# Altium project UCLA-DRS4-2.1.PrjPCB (part 6 of 7)

## Sheet Sensors.SchDoc: Sensors
size OrCAD B; SheetNumber: 24; SheetTotal: 32
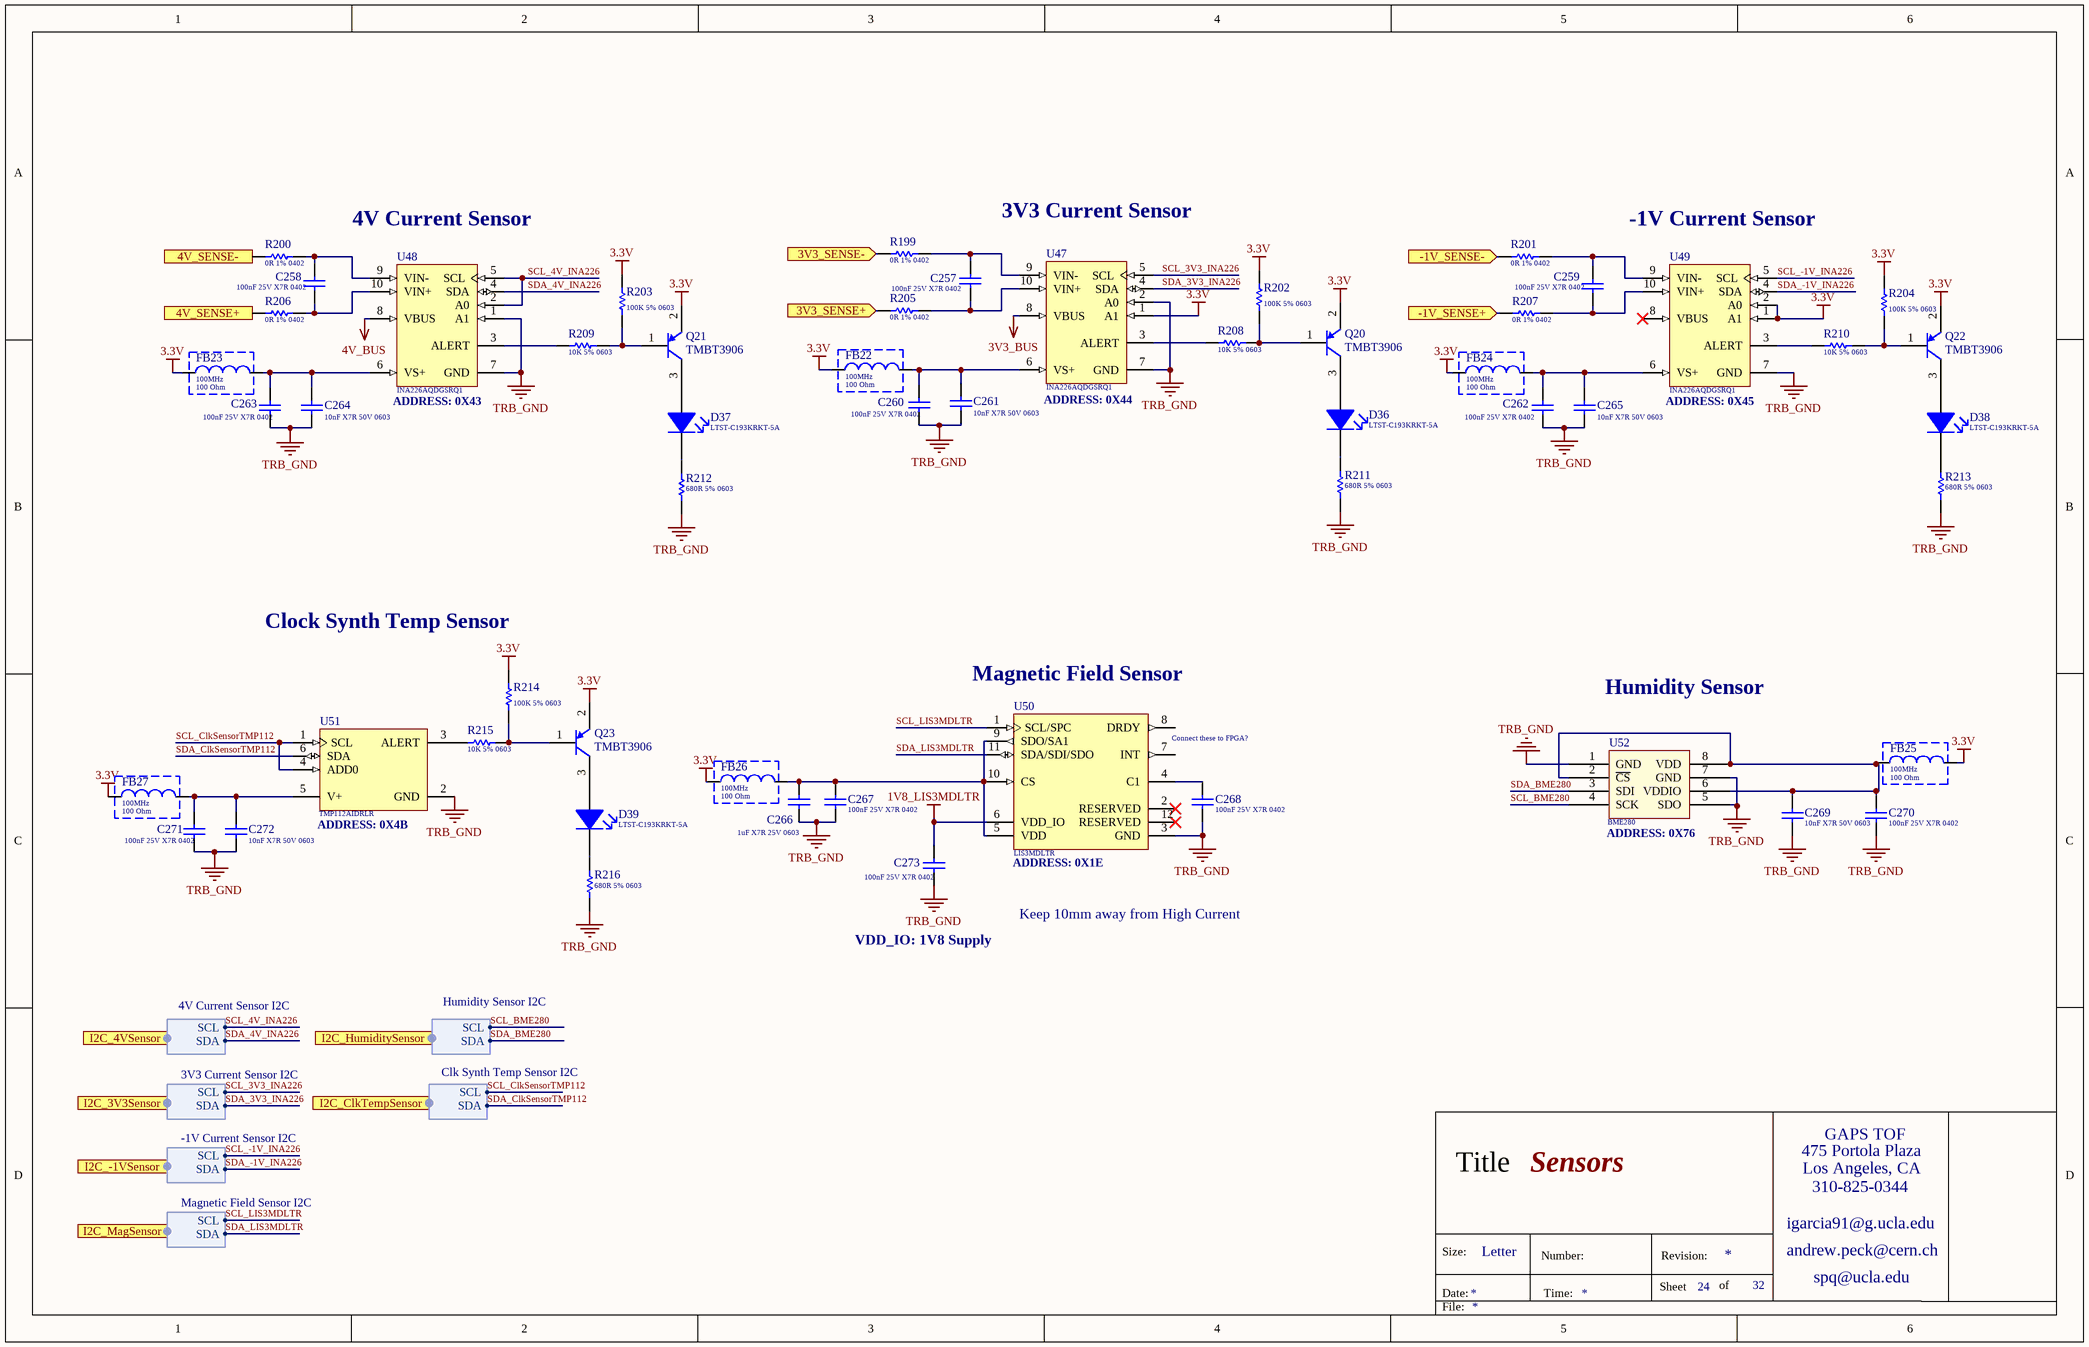
[diagram p23: Sensors.SchDoc]

### Parts
C257  Capacitance: 100nF 25V X7R 0402  [Cap_Taiyo_Yuden_TMK105B7104KV-FR_100nF]  (hidden comment: Cap_Taiyo_Yuden_TMK105B7104KV-FR_100nF)
C258  Capacitance: 100nF 25V X7R 0402  [Cap_Taiyo_Yuden_TMK105B7104KV-FR_100nF]  (hidden comment: Cap_Taiyo_Yuden_TMK105B7104KV-FR_100nF)
C259  Capacitance: 100nF 25V X7R 0402  [Cap_Taiyo_Yuden_TMK105B7104KV-FR_100nF]  (hidden comment: Cap_Taiyo_Yuden_TMK105B7104KV-FR_100nF)
C260  Capacitance: 100nF 25V X7R 0402  [Cap_Taiyo_Yuden_TMK105B7104KV-FR_100nF]  (hidden comment: Cap_Taiyo_Yuden_TMK105B7104KV-FR_100nF)
C261  Capacitance: 10nF X7R 50V 0603  [Kemet_C0603_0]  (hidden comment: Cap_Kemet_C0603C103J5RACTU_eec)
C262  Capacitance: 100nF 25V X7R 0402  [Cap_Taiyo_Yuden_TMK105B7104KV-FR_100nF]  (hidden comment: Cap_Taiyo_Yuden_TMK105B7104KV-FR_100nF)
C263  Capacitance: 100nF 25V X7R 0402  [Cap_Taiyo_Yuden_TMK105B7104KV-FR_100nF]  (hidden comment: Cap_Taiyo_Yuden_TMK105B7104KV-FR_100nF)
C264  Capacitance: 10nF X7R 50V 0603  [Kemet_C0603_0]  (hidden comment: Cap_Kemet_C0603C103J5RACTU_eec)
C265  Capacitance: 10nF X7R 50V 0603  [Kemet_C0603_0]  (hidden comment: Cap_Kemet_C0603C103J5RACTU_eec)
C266  Capacitance: 1uF X7R 25V 0603  [Cap_Murata_GCJ188R71E105KA01J_1uF]  (hidden comment: Cap_Murata_GCJ188R71E105KA01J_1uF)
C267  Capacitance: 100nF 25V X7R 0402  [Cap_Taiyo_Yuden_TMK105B7104KV-FR_100nF]  (hidden comment: Cap_Taiyo_Yuden_TMK105B7104KV-FR_100nF)
C268  Capacitance: 100nF 25V X7R 0402  [Cap_Taiyo_Yuden_TMK105B7104KV-FR_100nF]  (hidden comment: Cap_Taiyo_Yuden_TMK105B7104KV-FR_100nF)
C269  Capacitance: 10nF X7R 50V 0603  [Kemet_C0603_0]  (hidden comment: Cap_Kemet_C0603C103J5RACTU_eec)
C270  Capacitance: 100nF 25V X7R 0402  [Cap_Taiyo_Yuden_TMK105B7104KV-FR_100nF]  (hidden comment: Cap_Taiyo_Yuden_TMK105B7104KV-FR_100nF)
C271  Capacitance: 100nF 25V X7R 0402  [Cap_Taiyo_Yuden_TMK105B7104KV-FR_100nF]  (hidden comment: Cap_Taiyo_Yuden_TMK105B7104KV-FR_100nF)
C272  Capacitance: 10nF X7R 50V 0603  [Kemet_C0603_0]  (hidden comment: Cap_Kemet_C0603C103J5RACTU_eec)
C273  Capacitance: 100nF 25V X7R 0402  [Cap_Taiyo_Yuden_TMK105B7104KV-FR_100nF]  (hidden comment: Cap_Taiyo_Yuden_TMK105B7104KV-FR_100nF)
D36  LTST-C193KRKT-5A  [Led_Lite-On_LTST-C193KGKT-5A_Red]
D37  LTST-C193KRKT-5A  [Led_Lite-On_LTST-C193KGKT-5A_Red]
D38  LTST-C193KRKT-5A  [Led_Lite-On_LTST-C193KGKT-5A_Red]
D39  LTST-C193KRKT-5A  [Led_Lite-On_LTST-C193KGKT-5A_Red]
FB22  Measuring Frequency: 100MHz  Impedance: 100 Ohm  [FB_Wurth_Electronics_742792731_100Ohms]  (hidden comment: 742792731)
FB23  Measuring Frequency: 100MHz  Impedance: 100 Ohm  [FB_Wurth_Electronics_742792731_100Ohms]  (hidden comment: 742792731)
FB24  Measuring Frequency: 100MHz  Impedance: 100 Ohm  [FB_Wurth_Electronics_742792731_100Ohms]  (hidden comment: 742792731)
FB25  Measuring Frequency: 100MHz  Impedance: 100 Ohm  [FB_Wurth_Electronics_742792731_100Ohms]  (hidden comment: 742792731)
FB26  Measuring Frequency: 100MHz  Impedance: 100 Ohm  [FB_Wurth_Electronics_742792731_100Ohms]  (hidden comment: 742792731)
FB27  Measuring Frequency: 100MHz  Impedance: 100 Ohm  [FB_Wurth_Electronics_742792731_100Ohms]  (hidden comment: 742792731)
Q20  Series: TMBT3906  [BJT_PNP_Toshiba_TMBT3906]  (hidden comment: BJT_PNP_Toshiba_TMBT3906)
Q21  Series: TMBT3906  [BJT_PNP_Toshiba_TMBT3906]  (hidden comment: BJT_PNP_Toshiba_TMBT3906)
Q22  Series: TMBT3906  [BJT_PNP_Toshiba_TMBT3906]  (hidden comment: BJT_PNP_Toshiba_TMBT3906)
Q23  Series: TMBT3906  [BJT_PNP_Toshiba_TMBT3906]  (hidden comment: BJT_PNP_Toshiba_TMBT3906)
R199  Resistance: 0R 1% 0402  [Res_Vishay_CRCW04020000Z0EDC_0_Ohm]  (hidden comment: Res_Vishay_CRCW04020000Z0EDC_0_Ohm)
R200  Resistance: 0R 1% 0402  [Res_Vishay_CRCW04020000Z0EDC_0_Ohm]  (hidden comment: Res_Vishay_CRCW04020000Z0EDC_0_Ohm)
R201  Resistance: 0R 1% 0402  [Res_Vishay_CRCW04020000Z0EDC_0_Ohm]  (hidden comment: Res_Vishay_CRCW04020000Z0EDC_0_Ohm)
R202  100K 5% 0603  [RESC0603(1608)_N]
R203  100K 5% 0603  [RESC0603(1608)_N]
R204  100K 5% 0603  [RESC0603(1608)_N]
R205  Resistance: 0R 1% 0402  [Res_Vishay_CRCW04020000Z0EDC_0_Ohm]  (hidden comment: Res_Vishay_CRCW04020000Z0EDC_0_Ohm)
R206  Resistance: 0R 1% 0402  [Res_Vishay_CRCW04020000Z0EDC_0_Ohm]  (hidden comment: Res_Vishay_CRCW04020000Z0EDC_0_Ohm)
R207  Resistance: 0R 1% 0402  [Res_Vishay_CRCW04020000Z0EDC_0_Ohm]  (hidden comment: Res_Vishay_CRCW04020000Z0EDC_0_Ohm)
R208  10K 5% 0603  [RESC0603(1608)_L]
R209  10K 5% 0603  [RESC0603(1608)_L]
R210  10K 5% 0603  [RESC0603(1608)_L]
R211  680R 5% 0603  [RESC0603(1608)_L]
R212  680R 5% 0603  [RESC0603(1608)_L]
R213  680R 5% 0603  [RESC0603(1608)_L]
R214  100K 5% 0603  [RESC0603(1608)_N]
R215  10K 5% 0603  [RESC0603(1608)_L]
R216  680R 5% 0603  [RESC0603(1608)_L]
U47  INA226AQDGSRQ1  [INA226AQDGSRQ1]
U48  INA226AQDGSRQ1  [INA226AQDGSRQ1]
U49  INA226AQDGSRQ1  [INA226AQDGSRQ1]
U50  LIS3MDLTR  [LIS3MDLTR]
U51  TMP112AIDRLR  [TMP112AIDRLR]
U52  BME280  [BME280]

### Ports
3V3_SENSE+ (in), 3V3_SENSE- (in), 4V_SENSE+ (in), 4V_SENSE- (in), -1V_SENSE+ (in), -1V_SENSE- (in), I2C_3V3Sensor (harness 3V3 Current Sensor I2C), I2C_4VSensor (harness 4V Current Sensor I2C), I2C_-1VSensor (harness -1V Current Sensor I2C), I2C_ClkTempSensor (harness Clk Synth Temp Sensor I2C), I2C_HumiditySensor (harness Humidity Sensor I2C), I2C_MagSensor (harness Magnetic Field Sensor I2C)

### Harnesses
4V Current Sensor I2C: SCL, SDA
3V3 Current Sensor I2C: SCL, SDA
-1V Current Sensor I2C: SCL, SDA
Magnetic Field Sensor I2C: SCL, SDA
Humidity Sensor I2C: SCL, SDA
Clk Synth Temp Sensor I2C: SCL, SDA

### Nets
1V8_LIS3MDLTR: C273.2 U50.6(VDD_IO)
3.3V: FB22.1 FB23.1 FB24.1 FB25.2 FB26.1 FB27.1 Q20.2(E) Q21.2(E) Q22.2(E) Q23.2(E) R202.2 R203.2 R204.2 R214.2 U47.1(A1) U47.8(VBUS) U49.1(A1) U49.2(A0)  [also labelled 3V3_BUS]
4V_BUS: U48.8(VBUS)  [project net 4V]
TRB_GND: C260.1 C261.2 C262.1 C263.1 C264.2 C265.2 C266.1 C267.2 C268.2 C269.2 C270.2 C271.1 C272.2 C273.1 R211.1 R212.1 R213.1 R216.1 U47.2(A0) U47.7(GND) U48.1(A1) U48.7(GND) U49.7(GND) U50.3(GND) U51.2(GND) U52.1(GND) U52.5(SDO) U52.7(GND)
3V3_SENSE_N: R199.2 ; port 3V3_SENSE-
3V3_SENSE_P: R205.2 ; port 3V3_SENSE+
4V_SENSE_N: R200.2 ; port 4V_SENSE-
4V_SENSE_P: R206.2 ; port 4V_SENSE+
-1V_SENSE_N: R201.2 ; port -1V_SENSE-
-1V_SENSE_P: R207.2 ; port -1V_SENSE+
SCL_3V3_INA226: U47.5(SCL) ; port I2C_3V3Sensor.SCL
SCL_4V_INA226: U48.2(A0) U48.5(SCL) ; port I2C_4VSensor.SCL
SCL_-1V_INA226: U49.5(SCL) ; port I2C_-1VSensor.SCL
SCL_BME280: U52.4(SCK) ; port I2C_HumiditySensor.SCL
SCL_ClkSensorTMP112: U51.1(SCL) U51.4(ADD0) ; port I2C_ClkTempSensor.SCL
SCL_LIS3MDLTR: U50.1(SCL/SPC) ; port I2C_MagSensor.SCL
SDA_3V3_INA226: U47.4(SDA) ; port I2C_3V3Sensor.SDA
SDA_4V_INA226: U48.4(SDA) ; port I2C_4VSensor.SDA
SDA_-1V_INA226: U49.4(SDA) ; port I2C_-1VSensor.SDA
SDA_BME280: U52.3(SDI) ; port I2C_HumiditySensor.SDA
SDA_ClkSensorTMP112: U51.6(SDA) ; port I2C_ClkTempSensor.SDA
SDA_LIS3MDLTR: U50.11(SDA/SDI/SDO) ; port I2C_MagSensor.SDA
NetC257_1: C257.1 R205.1 U47.10(VIN+)
NetC257_2: C257.2 R199.1 U47.9(VIN-)
NetC258_1: C258.1 R206.1 U48.10(VIN+)
NetC258_2: C258.2 R200.1 U48.9(VIN-)
NetC259_1: C259.1 R207.1 U49.10(VIN+)
NetC259_2: C259.2 R201.1 U49.9(VIN-)
NetC260_2: C260.2 C261.1 FB22.2 U47.6(VS+)
NetC262_2: C262.2 C265.1 FB24.2 U49.6(VS+)
NetC263_2: C263.2 C264.1 FB23.2 U48.6(VS+)
NetC266_2: C266.2 C267.1 FB26.2 U50.5(VDD) U50.9(SDO/SA1) U50.10(CS)
NetC268_1: C268.1 U50.4(C1)
NetC269_1: C269.1 C270.1 FB25.1 U52.2(~{CS}) U52.6(VDDIO) U52.8(VDD)
NetC271_2: C271.2 C272.1 FB27.2 U51.5(V+)
NetD36_1: D36.1(K) R211.2
NetD36_2: D36.2(A) Q20.3(C)
NetD37_1: D37.1(K) R212.2
NetD37_2: D37.2(A) Q21.3(C)
NetD38_1: D38.1(K) R213.2
NetD38_2: D38.2(A) Q22.3(C)
NetD39_1: D39.1(K) R216.2
NetD39_2: D39.2(A) Q23.3(C)
NetQ20_1: Q20.1(B) R202.1 R208.1
NetQ21_1: Q21.1(B) R203.1 R209.1
NetQ22_1: Q22.1(B) R204.1 R210.1
NetQ23_1: Q23.1(B) R214.1 R215.1
NetR208_2: R208.2 U47.3(ALERT)
NetR209_2: R209.2 U48.3(ALERT)
NetR210_2: R210.2 U49.3(ALERT)
NetR215_2: R215.2 U51.3(ALERT)

Not connected (* = marked no-connect by the designer): U49 8(VBUS)*; U50 2(RESERVED)* 7(INT) 8(DRDY) 12(RESERVED)*

### Notes on the sheet
- 3V3 Current Sensor
- 4V Current Sensor
- -1V Current Sensor
- (near U48) ADDRESS: 0X43
- (near U47) ADDRESS: 0X44
- (near U49) ADDRESS: 0X45
- (near R214) Clock Synth Temp Sensor
- (near U50) Magnetic Field Sensor
- Humidity Sensor
- (near U50) Connect these to FPGA?
- (near U51) ADDRESS: 0X4B
- (near U50) ADDRESS: 0X1E
- (near U52) ADDRESS: 0X76
- VDD_IO: 1V8 Supply
- Keep 10mm away from High Current
- 475 Portola Plaza
- GAPS TOF
- Title
- igarcia91@g.ucla.edu
- Los Angeles, CA
- 310-825-0344
- Size:
- Date:
- Letter
- Number:
- Time:
- Sheet
- Revision:
- of
- andrew.peck@cern.ch
- spq@ucla.edu
- File:

### Library data of the parts
C257-C260 C262 C263 C267 C268 C270 C271 C273 = Cap_Taiyo_Yuden_TMK105B7104KV-FR_100nF: CAP CER 100nF 25V X7R 0402; Supplier 1: Mouser; Supplier Part Number 1: 963-TMK105B7104KV-FR
C261 C264 C265 C269 C272 = Cap_Kemet_C0603C103J5RACTU_eec: CAP CER 10nF 50V X7R 0603; Manufacturer: Kemet; Mfg Package Ident: C0603; Part Number: C0603C103J5RACTU; helpURL: https://upverter.com/upn/revision/8a8d0c297e33ac74/; ComponentLink2Description: Datasheet; Temperature: -55°C to +125°C; Package: C0603; Supplier 2: Mouser; Price: 0.0184203126773; Supplier 1: Digi-Key; ComponentLink1URL: https://upverter.com/upn/revision/8a8d0c297e33ac74/; Supplier Part Number 2: 80-C0603C103J5R; Supplier Part Number 1: 399-1092-1-ND; Value: 10nF; ComponentLink1Description: Upverter; ComponentLink2URL: https://content.kemet.com/datasheets/KEM_C1002_X7R_SMD.pdf; RoHS: TRUE; Mouser Part Number: 80-C0603C103J5R; Temperature Range High: +125°C; Digikey Description: CAP CER 10000PF 50V X7R 0603; Digikey Part Number: 399-1092-1-ND; Lead Free: yes; Temperature Range Low: -55°C; Voltage: 50V
C266 = Cap_Murata_GCJ188R71E105KA01J_1uF: CAP CER 1uF 25V X7R 0603; Supplier 1: Mouser; Supplier Part Number 1: 81-GCJ188R71E105KA1J
D36-D39 = Led_Lite-On_LTST-C193KGKT-5A_Red: Standard LEDs - SMD Red 470nm 28mcd 20mA; Supplier 1: Mouser; Supplier Part Number 1: 859-LTSTC193KRKT5A; Series: LTST-C193KRKT-5A
FB22-FB27 = FB_Wurth_Electronics_742792731_100Ohms: FB SMD 100 OHM 25% 1.2A 0402; DC Resistance: 90mOhm; Supplier 1: Mouser; Supplier Part Number 1: 710-742792731
Q20-Q23 = BJT_PNP_Toshiba_TMBT3906: Bipolar Transistors - BJT Transistor for Low Freq. Amplification; Supplier 1: Mouser; Supplier Part Number 1: TMBT3906,LM
R199-R201 R205-R207 = Res_Vishay_CRCW04020000Z0EDC_0_Ohm: 0R 0.062W 1% 0402 (1005 Metric)  SMD; Supplier 1: Mouser; Supplier Part Number 1: 71-CRCW04020000Z0EDC
R202-R204 R214 = CMP-1012-00122-1: 100K 0.1W 5% 0603 (1608 Metric)  SMD; Case-EIA: 0603; Value: 100000.00 Ohm; Case-Metric: 1608; Tolerance: 5 %; Power: 0.1 W; Technology: SMT
R208-R210 R215 = CMP-1012-00098-1: 10K 0.1W 5% 0603 (1608 Metric)  SMD; Case-EIA: 0603; Value: 10000.00 Ohm; Case-Metric: 1608; Technology: SMT; Tolerance: 5 %; Power: 0.1 W
R211-R213 R216 = CMP-1012-00070-1: 680R 0.1W 5% 0603 (1608 Metric)  SMD; Case-EIA: 0603; Value: 680.00 Ohm; Case-Metric: 1608; Tolerance: 5 %; Technology: SMT; Power: 0.1 W
U47-U49 = INA226AQDGSRQ1: Current & Power Monitors & Regulators Automotive, 36-V, Ultra-High Accuracy, Low-/High-Side, I2C Out Current/Power Monitor w/ Alert 10-VSSOP -40 to 125; Supplier 1: Mouser; Supplier Part Number 1: 595-INA226AQDGSRQ1
U50 = LIS3MDLTR: Board Mount Hall Effect / Magnetic Sensors Ultra Lo-Pwr Hi Perf 3-Axis 1.9-3.6V; Supplier 1: Mouser; Supplier Part Number 1: 511-LIS3MDLTR
U51 = TMP112AIDRLR: Board Mount Temperature Sensors Hi-Prec Lo-Pwr Dig Temp Sensor; Supplier 1: Mouser; Supplier Part Number 1: 595-TMP112AIDRLR
U52 = BME280: Board Mount Humidity Sensors; Supplier 1: Mouser; Supplier Part Number 1: 262-BME280

## Sheet MARS_GPIO_MISC.SchDoc: My title
size A3; Organization: University of California; Address1: 475 Portola Plaza; Address2: Los Angeles, CA 90095; Revision: R01; SheetNumber: 1; SheetTotal: 1
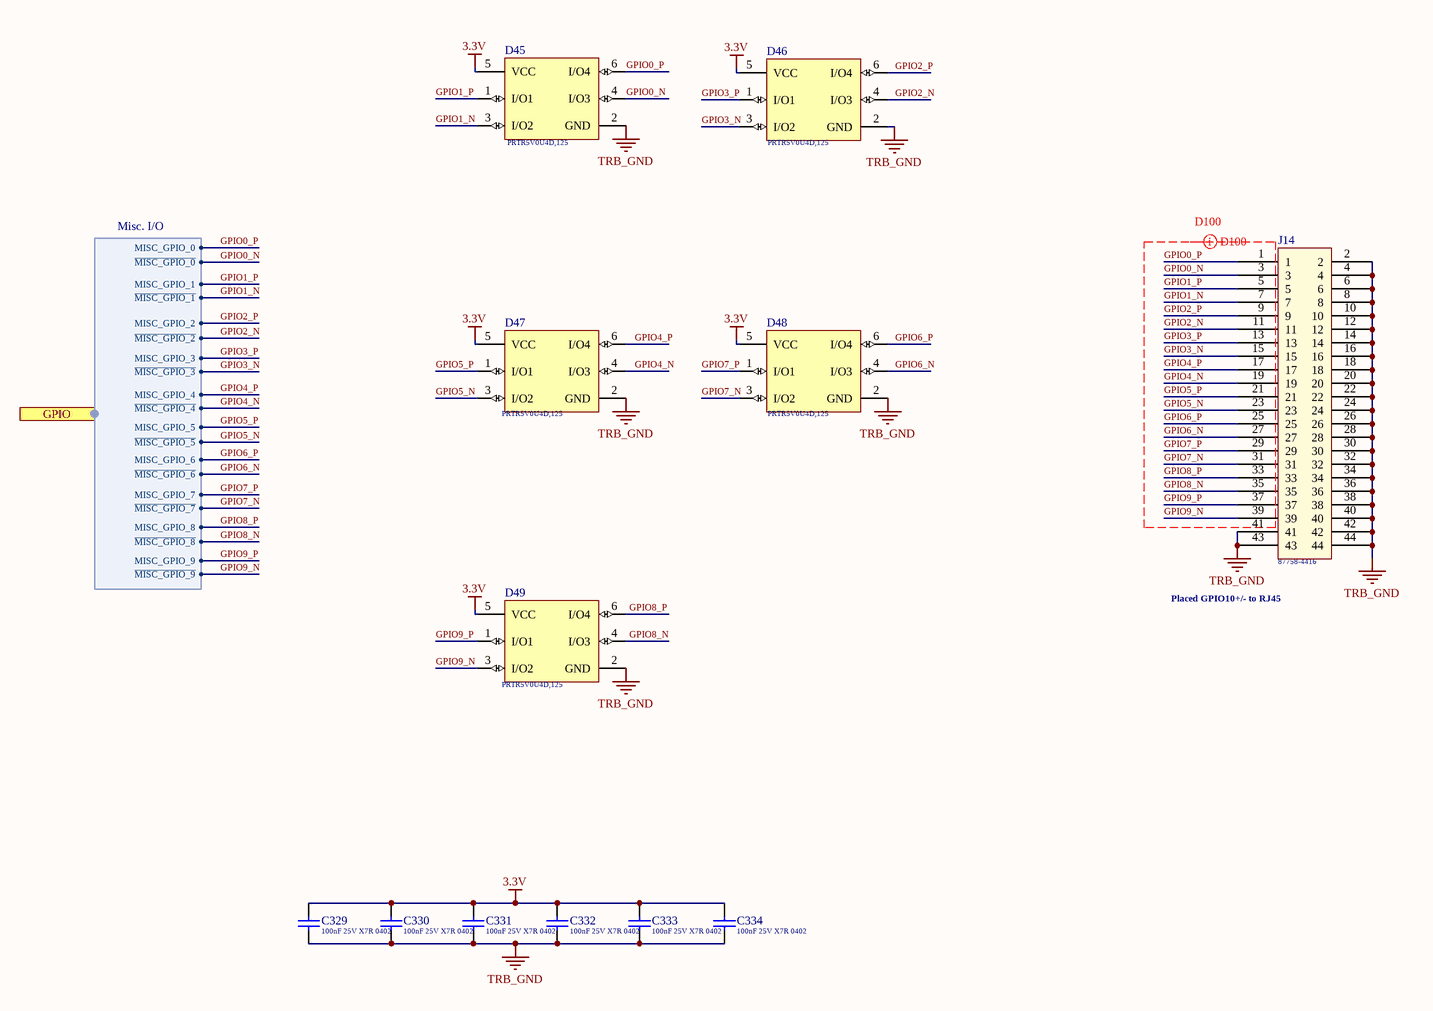
[diagram p24: MARS_GPIO_MISC.SchDoc]

### Parts
C329  Capacitance: 100nF 25V X7R 0402  [Cap_Taiyo_Yuden_TMK105B7104KV-FR_100nF]  (hidden comment: Cap_Taiyo_Yuden_TMK105B7104KV-FR_100nF)
C330  Capacitance: 100nF 25V X7R 0402  [Cap_Taiyo_Yuden_TMK105B7104KV-FR_100nF]  (hidden comment: Cap_Taiyo_Yuden_TMK105B7104KV-FR_100nF)
C331  Capacitance: 100nF 25V X7R 0402  [Cap_Taiyo_Yuden_TMK105B7104KV-FR_100nF]  (hidden comment: Cap_Taiyo_Yuden_TMK105B7104KV-FR_100nF)
C332  Capacitance: 100nF 25V X7R 0402  [Cap_Taiyo_Yuden_TMK105B7104KV-FR_100nF]  (hidden comment: Cap_Taiyo_Yuden_TMK105B7104KV-FR_100nF)
C333  Capacitance: 100nF 25V X7R 0402  [Cap_Taiyo_Yuden_TMK105B7104KV-FR_100nF]  (hidden comment: Cap_Taiyo_Yuden_TMK105B7104KV-FR_100nF)
C334  Capacitance: 100nF 25V X7R 0402  [Cap_Taiyo_Yuden_TMK105B7104KV-FR_100nF]  (hidden comment: Cap_Taiyo_Yuden_TMK105B7104KV-FR_100nF)
D45  PRTR5V0U4D,125  [PRTR5V0U4D,125]
D46  PRTR5V0U4D,125  [PRTR5V0U4D,125]
D47  PRTR5V0U4D,125  [PRTR5V0U4D,125]
D48  PRTR5V0U4D,125  [PRTR5V0U4D,125]
D49  PRTR5V0U4D,125  [PRTR5V0U4D,125]
J14  Series: 87758-4416  [Header_Molex_87758-4416_44POS]  (hidden comment: Header_Molex_87758-4416_44POS)

### Ports
GPIO (harness Misc. I/O)

### Harnesses
Misc. I/O: MISC_GPIO_0, ~{MISC_GPIO_0}, MISC_GPIO_1, ~{MISC_GPIO_1}, MISC_GPIO_2, ~{MISC_GPIO_2}, MISC_GPIO_3, ~{MISC_GPIO_3}, MISC_GPIO_4, ~{MISC_GPIO_4}, MISC_GPIO_5, ~{MISC_GPIO_5}, MISC_GPIO_6, ~{MISC_GPIO_6}, MISC_GPIO_7, ~{MISC_GPIO_7}, MISC_GPIO_8, ~{MISC_GPIO_8}, MISC_GPIO_9, ~{MISC_GPIO_9}

### Nets
3.3V: C329.2 C330.2 C331.2 C332.2 C333.2 C334.2 D45.5(VCC) D46.5(VCC) D47.5(VCC) D48.5(VCC) D49.5(VCC)
TRB_GND: C329.1 C330.1 C331.1 C332.1 C333.1 C334.1 D45.2(GND) D46.2(GND) D47.2(GND) D48.2(GND) D49.2(GND) J14.2 J14.4 J14.6 J14.8 J14.10 J14.12 J14.14 J14.16 J14.18 J14.20 J14.22 J14.24 J14.26 J14.28 J14.30 J14.32 J14.34 J14.36 J14.38 J14.40 J14.41 J14.42 J14.43 J14.44
GPIO0_N: D45.4(I/O3) J14.3 ; port GPIO.~{MISC_GPIO_0}
GPIO0_P: D45.6(I/O4) J14.1 ; port GPIO.MISC_GPIO_0
GPIO1_N: D45.3(I/O2) J14.7 ; port GPIO.~{MISC_GPIO_1}
GPIO1_P: D45.1(I/O1) J14.5 ; port GPIO.MISC_GPIO_1
GPIO2_N: D46.4(I/O3) J14.11 ; port GPIO.~{MISC_GPIO_2}
GPIO2_P: D46.6(I/O4) J14.9 ; port GPIO.MISC_GPIO_2
GPIO3_N: D46.3(I/O2) J14.15 ; port GPIO.~{MISC_GPIO_3}
GPIO3_P: D46.1(I/O1) J14.13 ; port GPIO.MISC_GPIO_3
GPIO4_N: D47.4(I/O3) J14.19 ; port GPIO.~{MISC_GPIO_4}
GPIO4_P: D47.6(I/O4) J14.17 ; port GPIO.MISC_GPIO_4
GPIO5_N: D47.3(I/O2) J14.23 ; port GPIO.~{MISC_GPIO_5}
GPIO5_P: D47.1(I/O1) J14.21 ; port GPIO.MISC_GPIO_5
GPIO6_N: D48.4(I/O3) J14.27 ; port GPIO.~{MISC_GPIO_6}
GPIO6_P: D48.6(I/O4) J14.25 ; port GPIO.MISC_GPIO_6
GPIO7_N: D48.3(I/O2) J14.31 ; port GPIO.~{MISC_GPIO_7}
GPIO7_P: D48.1(I/O1) J14.29 ; port GPIO.MISC_GPIO_7
GPIO8_N: D49.4(I/O3) J14.35 ; port GPIO.~{MISC_GPIO_8}
GPIO8_P: D49.6(I/O4) J14.33 ; port GPIO.MISC_GPIO_8
GPIO9_N: D49.3(I/O2) J14.39 ; port GPIO.~{MISC_GPIO_9}
GPIO9_P: D49.1(I/O1) J14.37 ; port GPIO.MISC_GPIO_9

### Layout directives
differential pair; differential pair class D100: GPIO0_N, GPIO0_P, GPIO1_N, GPIO1_P, GPIO2_N, GPIO2_P, GPIO3_N, GPIO3_P, GPIO4_N, GPIO4_P, GPIO5_N, GPIO5_P, GPIO6_N, GPIO6_P, GPIO7_N, GPIO7_P, GPIO8_N, GPIO8_P, GPIO9_N, GPIO9_P

### Notes on the sheet
- D100
- (near J14) Placed GPIO10+/- to RJ45
- 475 Portola Plaza
- GAPS TOF
- igarcia91@g.ucla.edu
- Los Angeles, CA
- 310-825-0344
- Size:
- Date:
- Letter
- Number:
- Time:
- Sheet
- Revision:
- of
- andrew.peck@cern.ch
- spq@ucla.edu
- File:

### Library data of the parts
C329-C334 = Cap_Taiyo_Yuden_TMK105B7104KV-FR_100nF: CAP CER 100nF 25V X7R 0402; Supplier 1: Mouser; Supplier Part Number 1: 963-TMK105B7104KV-FR
D45-D49 = PRTR5V0U4D,125: ESD Suppressors / TVS Diodes 5.5V QUAD R-R ESD ULTRA LOW CAP; Supplier 1: Mouser; Supplier Part Number 1: 771-PRTR5V0U4D-T/R
J14 = Header_Molex_87758-4416_44POS: Headers & Wire Housings VERT HEADER 44P Lead Free; Supplier Part Number 1: 538-87758-4416; Supplier 1: Mouser

## Sheet MARS_FTDI.SchDoc: My title
size A3; Organization: University of California; Address1: 475 Portola Plaza; Address2: Los Angeles, CA 90095; Revision: R01; SheetNumber: 1; SheetTotal: 1
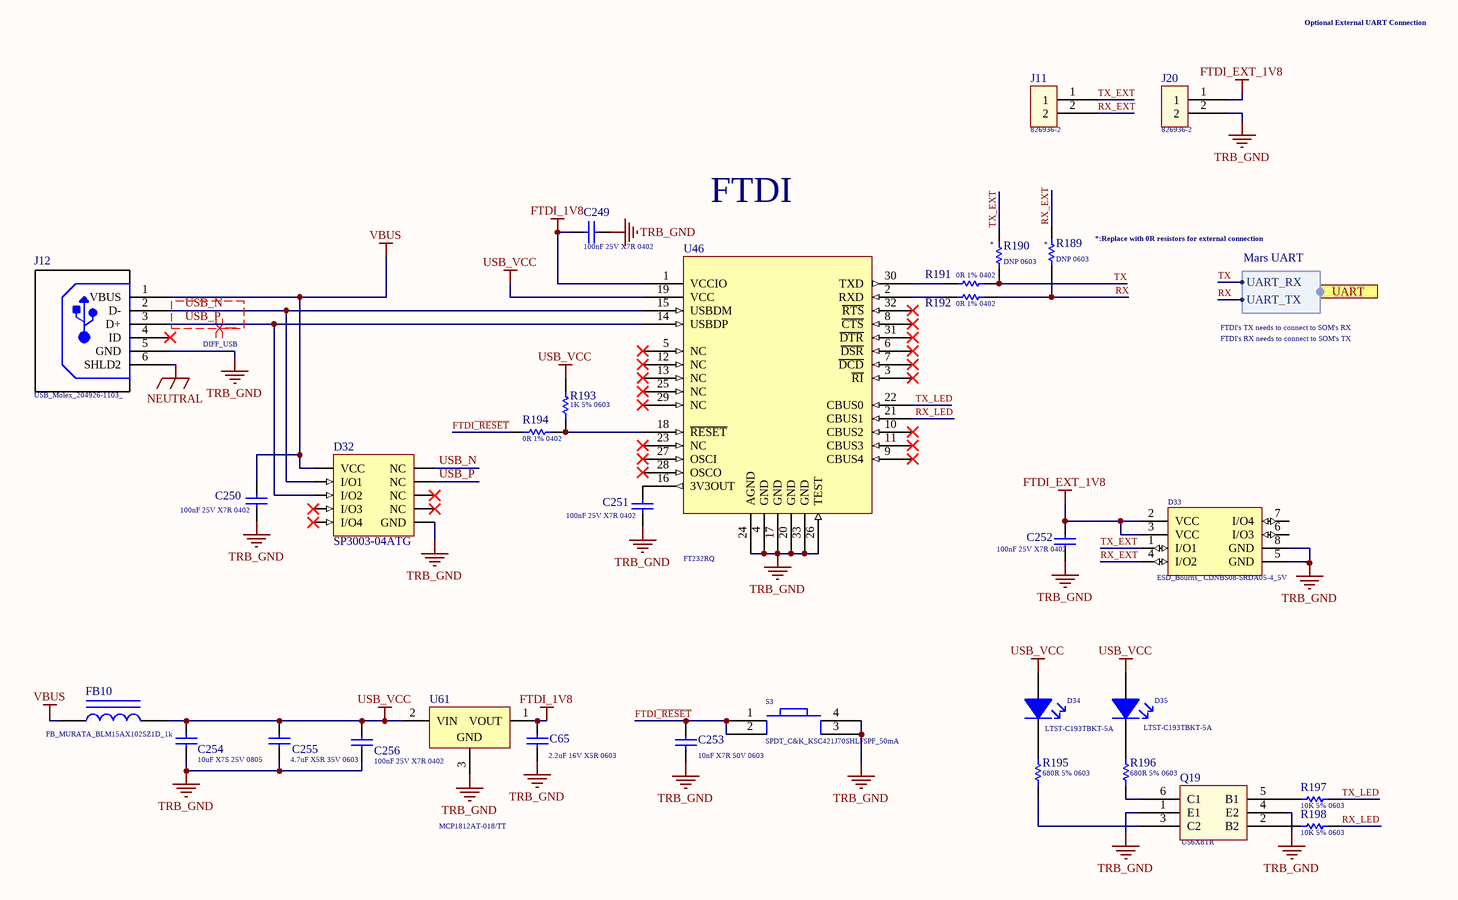
[diagram p25: MARS_FTDI.SchDoc]

### Parts
C65  Capacitance: 2.2uF 16V X5R 0603  [CAPC0603(1608)100_L]  (hidden comment: Cap_Taiyo_Yuden_2.2uF)
C249  Capacitance: 100nF 25V X7R 0402  [Cap_Taiyo_Yuden_TMK105B7104KV-FR_100nF]  (hidden comment: Cap_Taiyo_Yuden_TMK105B7104KV-FR_100nF)
C250  Capacitance: 100nF 25V X7R 0402  [Cap_Taiyo_Yuden_TMK105B7104KV-FR_100nF]  (hidden comment: Cap_Taiyo_Yuden_TMK105B7104KV-FR_100nF)
C251  Capacitance: 100nF 25V X7R 0402  [Cap_Taiyo_Yuden_TMK105B7104KV-FR_100nF]  (hidden comment: Cap_Taiyo_Yuden_TMK105B7104KV-FR_100nF)
C252  Capacitance: 100nF 25V X7R 0402  [Cap_Taiyo_Yuden_TMK105B7104KV-FR_100nF]  (hidden comment: Cap_Taiyo_Yuden_TMK105B7104KV-FR_100nF)
C253  Capacitance: 10nF X7R 50V 0603  [Kemet_C0603_0]  (hidden comment: Cap_Kemet_C0603C103J5RACTU_eec)
C254  Capacitance: 10uF X7S 25V 0805  [Cap_Murata_ GRM21BC71E106ME11L_10uF]  (hidden comment: Cap_Murata_ GRM21BC71E106ME11L_10uF)
C255  Capacitance: 4.7uF X5R 35V 0603  [Cap_Murata_ZRB18AR6YA475ME05L_4.7uF]  (hidden comment: Cap_Murata_ZRB18AR6YA475ME05L_4.7uF)
C256  Capacitance: 100nF 25V X7R 0402  [Cap_Taiyo_Yuden_TMK105B7104KV-FR_100nF]  (hidden comment: Cap_Taiyo_Yuden_TMK105B7104KV-FR_100nF)
D32  Series: SP3003-04ATG  [Diode_SP3003-04ATG_LVDS_ESD]  (hidden comment: Diode_SP3003-04ATG_LVDS_ESD)
D33  ESD_Bourns_ CDNBS08-SRDA05-4_5V  [ESD_Bourns_ CDNBS08-SRDA05-4_5V]
D34  Series: LTST-C193TBKT-5A  [Led_Lite-On_LTST-C193TBKT-5A_Blue]  (hidden comment: Led_Lite-On_LTST-C193TBKT-5A_Blue)
D35  Series: LTST-C193TBKT-5A  [Led_Lite-On_LTST-C193TBKT-5A_Blue]  (hidden comment: Led_Lite-On_LTST-C193TBKT-5A_Blue)
FB10  FB_MURATA_BLM15AX102SZ1D_1k  [FB_MURATA_BLM15AX102SZ1D_1k]
J11  Series: 826936-2  [Header_TE_Connectivity_826936-2_2POS_5A]  (hidden comment: Header_TE_Connectivity_826936-2_2POS_5A)
J12  USB_Molex_204926-1103_  [USB_Molex_204926-1103]
J20  Series: 826936-2  [Header_TE_Connectivity_826936-2_2POS_5A]  (hidden comment: Header_TE_Connectivity_826936-2_2POS_5A)
Q19  Series: US6X8TR  [BJT_ROHM_US6X8TR_1A_NPN]  (hidden comment: BJT_ROHM_US6X8TR_1A_NPN)
R189  Resistance: DNP 0603  [RES_DNP_0603]  (hidden comment: RES_DNP_0603)
R190  Resistance: DNP 0603  [RES_DNP_0603]  (hidden comment: RES_DNP_0603)
R191  Resistance: 0R 1% 0402  [Res_Vishay_CRCW04020000Z0EDC_0_Ohm]  (hidden comment: Res_Vishay_CRCW04020000Z0EDC_0_Ohm)
R192  Resistance: 0R 1% 0402  [Res_Vishay_CRCW04020000Z0EDC_0_Ohm]  (hidden comment: Res_Vishay_CRCW04020000Z0EDC_0_Ohm)
R193  1K 5% 0603  [RESC0603(1608)_L]
R194  Resistance: 0R 1% 0402  [Res_Vishay_CRCW04020000Z0EDC_0_Ohm]  (hidden comment: Res_Vishay_CRCW04020000Z0EDC_0_Ohm)
R195  680R 5% 0603  [RESC0603(1608)_L]
R196  680R 5% 0603  [RESC0603(1608)_L]
R197  10K 5% 0603  [RESC0603(1608)_L]
R198  10K 5% 0603  [RESC0603(1608)_L]
S3  SPDT_C&K_KSC421J70SHLFSPF_50mA  [SPDT_C&K_KSC421J70SHLFSPF_50mA]
U46  Series: FT232RQ  [IC_FTDI_FT232RQ-REEL]  (hidden comment: IC_FTDI_FT232RQ-REEL)
U61  Series: MCP1812AT-018/TT  [LDO_Microchip_MCP1812AT-018_1V8]  (hidden comment: LDO_Microchip_MCP1812AT-018_1V8)

### Ports
UART (harness Mars UART)

### Harnesses
Mars UART: UART_RX, UART_TX

### Nets
FTDI_1V8: C65.2 C249.2 U46.1(VCCIO) U61.1(VOUT)
FTDI_EXT_1V8: C252.2 D33.2(VCC) D33.3(VCC) J20.1
NEUTRAL: J12.6(SHLD2)
TRB_GND: C65.1 C249.1 C250.1 C251.1 C252.1 C253.2 C254.2 C255.1 C256.1 D32.8(GND) D33.5(GND) D33.8(GND) J12.5(GND) J20.2 Q19.1(E1) Q19.4(E2) S3.3 S3.4 U46.4(GND) U46.17(GND) U46.20(GND) U46.24(AGND) U46.26(TEST) U46.33(GND) U61.3(GND)
USB_VCC: C254.1 C255.2 C256.2 D34.2(A) D35.2(A) FB10.2 R193.2 U46.19(VCC) U61.2(VIN)
VBUS: C250.2 D32.3(VCC) FB10.1 J12.1(VBUS)
FTDI~{_RESET}: C253.1 R194.2 S3.1 S3.2
RX: R189.2 R192.2 ; port UART.UART_TX  [project net IO_MIO47_B13_L19_U5]
RX_EXT: D33.4(I/O2) J11.2 R189.1
RX_LED: R198.1 U46.21(CBUS1)
TX: R190.2 R191.2 ; port UART.UART_RX  [project net IO_MIO46_B13_L19_T5]
TX_EXT: D33.1(I/O1) J11.1 R190.1
TX_LED: R197.2 U46.22(CBUS0)
USB_N: D32.1(I/O1) D32.10(NC) J12.2(D-) U46.15(USBDM)
USB_P: D32.2(I/O2) D32.9(NC) J12.3(D+) U46.14(USBDP)
NetC251_2: C251.2 U46.16(3V3OUT)
NetD34_1: D34.1(K) R195.2
NetD35_1: D35.1(K) R196.2
NetQ19_2: Q19.2(B2) R198.2
NetQ19_3: Q19.3(C2) R195.1
NetQ19_5: Q19.5(B1) R197.1
NetQ19_6: Q19.6(C1) R196.1
NetR191_1: R191.1 U46.30(TXD)
NetR192_1: R192.1 U46.2(RXD)
NetR193_1: R193.1 R194.1 U46.18(~{RESET})

Not connected (* = marked no-connect by the designer): D32 4(I/O3)* 5(I/O4)* 6(NC)* 7(NC)*; D33 6(I/O3) 7(I/O4); J12 4(ID)*; U46 3(~{RI})* 5(NC)* 6(~{DSR})* 7(~{DCD})* 8(~{CTS})* 9(CBUS4)* 10(CBUS2)* 11(CBUS3)* 12(NC)* 13(NC)* 23(NC)* 25(NC)* 27(OSCI)* 28(OSCO)* 29(NC)* 31(~{DTR})* 32(~{RTS})*

### Layout directives
differential pair; differential pair class DIFF_USB: USB_N, USB_P

### Notes on the sheet
- Optional External UART Connection
- FTDI
- (near R190) *
- (near R189) *
- (near R189) *:Replace with 0R resistors for external connection
- FTDI's TX needs to connect to SOM's RX
- FTDI's RX needs to connect to SOM's TX
- 475 Portola Plaza
- GAPS TOF
- igarcia91@g.ucla.edu
- Los Angeles, CA
- 310-825-0344
- Size:
- Date:
- Letter
- Number:
- Time:
- Sheet
- Revision:
- of
- andrew.peck@cern.ch
- spq@ucla.edu
- File:

### Library data of the parts
C65 = CMP-1035-02763-1: CAP 2.2uF 16V ±10% 0603 (1608 Metric) Thickness 1mm SMD; Case-Metric: 1608; Case-EIA: 0603; Tolerance: Â±10%; Value: 2.2uF; Max Thickness: 1 mm; Technology: SMT; Rated Voltage: 16 V; Parameter 1: *
C249-C252 C256 = Cap_Taiyo_Yuden_TMK105B7104KV-FR_100nF: CAP CER 100nF 25V X7R 0402; Supplier 1: Mouser; Supplier Part Number 1: 963-TMK105B7104KV-FR
C253 = Cap_Kemet_C0603C103J5RACTU_eec: as C261 on sheet Sensors; Part Number: C0603C103J5RACTU; helpURL: https://upverter.com/upn/revision/8a8d0c297e33ac74/; ComponentLink2Description: Datasheet; Temperature: -55°C to +125°C; Package: C0603; Supplier 2: Mouser; Price: 0.0184203126773; Supplier 1: Digi-Key; ComponentLink1URL: https://upverter.com/upn/revision/8a8d0c297e33ac74/; Supplier Part Number 2: 80-C0603C103J5R; Supplier Part Number 1: 399-1092-1-ND; Value: 10nF; ComponentLink1Description: Upverter; ComponentLink2URL: https://content.kemet.com/datasheets/KEM_C1002_X7R_SMD.pdf; RoHS: TRUE; Mouser Part Number: 80-C0603C103J5R; Temperature Range High: +125°C; Digikey Description: CAP CER 10000PF 50V X7R 0603; Digikey Part Number: 399-1092-1-ND; Lead Free: yes; Temperature Range Low: -55°C; Voltage: 50V
C254 = Cap_Murata_ GRM21BC71E106ME11L_10uF: CAP CER 10uF 25V X7R 0805; Supplier 1: Mouser; Supplier Part Number 1: 81-GRM21BC71E106ME1L
C255 = Cap_Murata_ZRB18AR6YA475ME05L_4.7uF: CAP CER 4.7uF 35V X5R 0603; Supplier 1: Mouser; Supplier Part Number 1: 81-ZRB18AR6YA475ME5L
D32 = Diode_SP3003-04ATG_LVDS_ESD: ESD Suppressors / TVS Diodes 4 Ch 8kV 0.65pF SPA; Supplier 1: Mouser; Supplier Part Number 1: 576-SP3003-04ATG
D33 = ESD_Bourns_ CDNBS08-SRDA05-4_5V: ESD Suppressors / TVS Diodes SO-8 5V 500W Low Capacitance; Supplier Part Number 1: 652-CDNBS08-SRDA05-4; Supplier 1: Mouser
D34 D35 = Led_Lite-On_LTST-C193TBKT-5A_Blue: Standard LEDs - SMD Blue 470nm 28mcd 20mA; Supplier 1: Mouser; Supplier Part Number 1: 859-LTSTC193TBKT5A
FB10 = FB_MURATA_BLM15AX102SZ1D_1k: FB SMD 1000 OHM 25% 3/4W 0402; Supplier Part Number 1: 81-BLM15AX102SZ1D; Supplier 1: Mouser
J11 J20 = Header_TE_Connectivity_826936-2_2POS_5A: Headers & Wire Housings 2P SINGLE ROW 5A; Supplier Part Number 1: 571-826936-2; Supplier 1: Mouser
J12 = USB_Molex_204926-1103: USB Connectors MicroUSB B Rec SMT WOut Flange WtrProf; Series: 204926-1103; Supplier Part Number 1: 538-204926-1103; Supplier 1: Mouser
Q19 = BJT_ROHM_US6X8TR_1A_NPN: Bipolar Transistors - BJT NPN+NPN 30VCEO 1A SOT-363T; Supplier Part Number 1: 755-US6X8TR; Supplier 1: Mouser
R189 R190 = RES_DNP_0603: 0603 Do not place resistor
R191 R192 R194 = Res_Vishay_CRCW04020000Z0EDC_0_Ohm: 0R 0.062W 1% 0402 (1005 Metric)  SMD; Supplier 1: Mouser; Supplier Part Number 1: 71-CRCW04020000Z0EDC
R193 = CMP-1012-00074-1: 1K 0.1W 5% 0603 (1608 Metric)  SMD; Case-EIA: 0603; Case-Metric: 1608; Value: 1000.00 Ohm; Technology: SMT; Tolerance: 5 %; Power: 0.1 W
R195 R196 = CMP-1012-00070-1: as R211-R213 on sheet Sensors; Tolerance: 5 %; Technology: SMT; Power: 0.1 W
R197 R198 = CMP-1012-00098-1: as R208-R210 on sheet Sensors; Technology: SMT; Tolerance: 5 %; Power: 0.1 W
S3 = SPDT_C&K_KSC421J70SHLFSPF_50mA: Tactile Switches Tact 6.2 x 6.2, 5.1 mm H, 1.7N, J leads, Potting Friendly, IP67; Supplier 1: Mouser; Supplier Part Number 1: 611-KSC421J70SHLFSPF
U46 = IC_FTDI_FT232RQ-REEL: USB Interface IC USB to Serial UART Enhanced IC QFN-32; Supplier 1: Mouser; Supplier Part Number 1: 895-FT232RQ
U61 = LDO_Microchip_MCP1812AT-018_1V8: LDO Voltage Regulators Ultra Low Iq LDO; Supplier 1: Mouser; Supplier Part Number 1: 579-MCP1812AT-018/TT

## Sheet DRS4_GPIO_EXPANDER_MODULE.SchDoc: GPIO Exp Module
size Letter; SheetNumber: 15; SheetTotal: 32
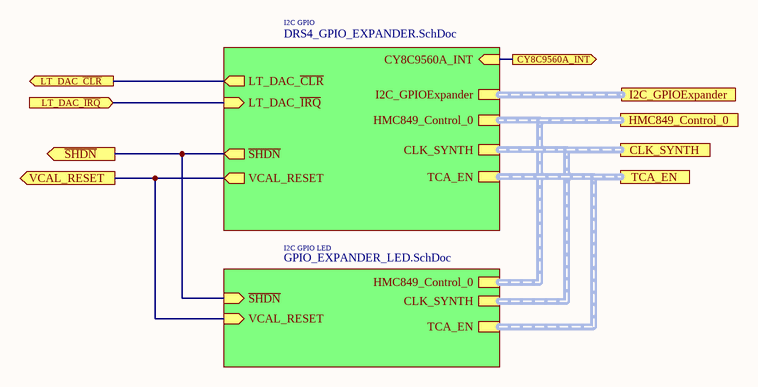
[diagram p26: DRS4_GPIO_EXPANDER_MODULE.SchDoc]

### Sub-sheets
I2C GPIO = DRS4_GPIO_EXPANDER.SchDoc: HMC849_Control_0 (harness HMC849 Control 0), I2C_GPIOExpander (harness GPIO Expander I2C), CLK_SYNTH (harness CLK SYNTH CONTROL), TCA_EN (harness TCA EN), ~{SHDN} (out), VCAL_RESET (out), LT_DAC_~{CLR} (out), LT_DAC_~{IRQ} (in), CY8C9560A_INT (in)
I2C GPIO LED = GPIO_EXPANDER_LED.SchDoc: HMC849_Control_0 (harness HMC849 Control 0), CLK_SYNTH (harness CLK SYNTH CONTROL), TCA_EN (harness TCA EN), ~{SHDN} (in), VCAL_RESET (in)

### Ports
CLK_SYNTH (harness CLK SYNTH CONTROL), CY8C9560A_INT (out), HMC849_Control_0 (harness HMC849 Control 0), I2C_GPIOExpander (harness GPIO Expander I2C), LT_DAC_~{CLR} (out), LT_DAC_~{IRQ} (in), TCA_EN (harness TCA EN), VCAL_RESET (out), ~{SHDN} (out)

### Nets
DAC_~{CLR}: port LT_DAC_~{CLR}, sheet I2C GPIO/LT_DAC_~{CLR}
DAC_~{IRQ}: port LT_DAC_~{IRQ}, sheet I2C GPIO/LT_DAC_~{IRQ}
IO_B35_L15_AD12_F20_N: port CY8C9560A_INT, sheet I2C GPIO/CY8C9560A_INT
~{SHDN}: port ~{SHDN}, sheet I2C GPIO/~{SHDN}, sheet I2C GPIO LED/~{SHDN}
VCAL_RESET: port VCAL_RESET, sheet I2C GPIO/VCAL_RESET, sheet I2C GPIO LED/VCAL_RESET

### Buses and harness runs
harness port CLK_SYNTH = sheet I2C GPIO LED/CLK_SYNTH = sheet I2C GPIO/CLK_SYNTH
harness port HMC849_Control_0 = sheet I2C GPIO LED/HMC849_Control_0 = sheet I2C GPIO/HMC849_Control_0
harness port I2C_GPIOExpander = sheet I2C GPIO/I2C_GPIOExpander
harness port TCA_EN = sheet I2C GPIO LED/TCA_EN = sheet I2C GPIO/TCA_EN

### Notes on the sheet
- 475 Portola Plaza
- GAPS TOF
- Title
- igarcia91@g.ucla.edu
- Los Angeles, CA
- 310-825-0344
- Size:
- Date:
- Letter
- Number:
- Time:
- Sheet
- Revision:
- of
- andrew.peck@cern.ch
- spq@ucla.edu
- File:

## Sheet DRS4_GPIO_EXPANDER.SchDoc: My title
size A3; Organization: University of California; Address1: 475 Portola Plaza; Address2: Los Angeles, CA 90095; Revision: R01; SheetNumber: 1; SheetTotal: 1
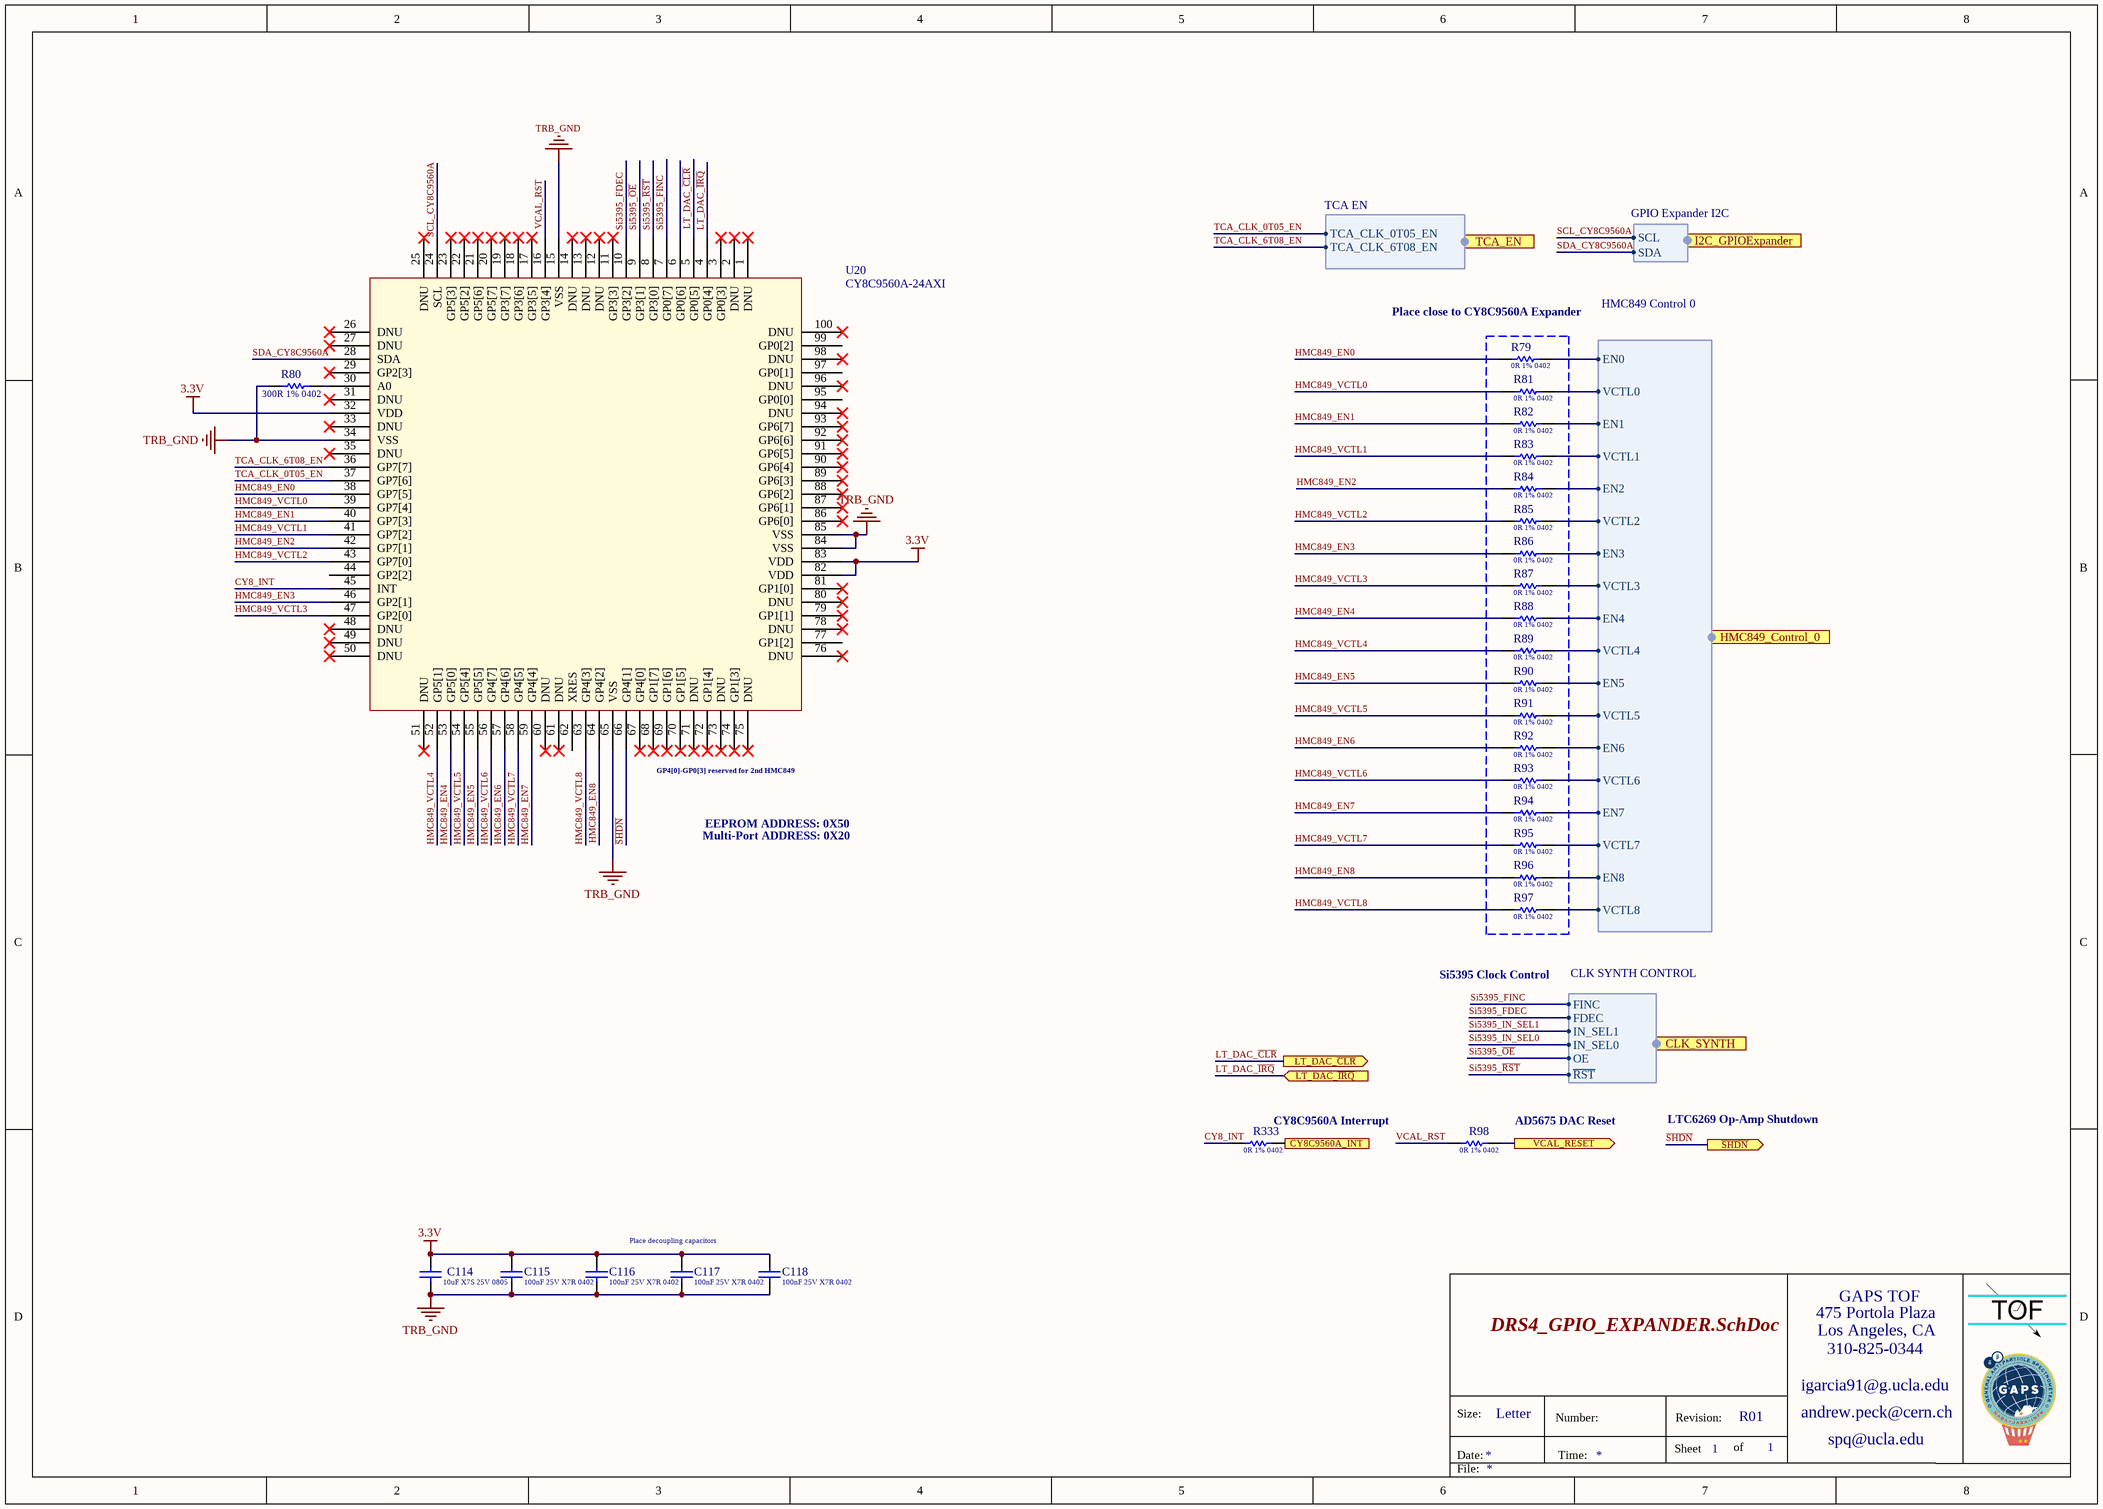
[diagram p27: DRS4_GPIO_EXPANDER.SchDoc]

### Parts
C114  Capacitance: 10uF X7S 25V 0805  [Cap_Murata_ GRM21BC71E106ME11L_10uF]  (hidden comment: Cap_Murata_ GRM21BC71E106ME11L_10uF)
C115  Capacitance: 100nF 25V X7R 0402  [Cap_Taiyo_Yuden_TMK105B7104KV-FR_100nF]  (hidden comment: Cap_Taiyo_Yuden_TMK105B7104KV-FR_100nF)
C116  Capacitance: 100nF 25V X7R 0402  [Cap_Taiyo_Yuden_TMK105B7104KV-FR_100nF]  (hidden comment: Cap_Taiyo_Yuden_TMK105B7104KV-FR_100nF)
C117  Capacitance: 100nF 25V X7R 0402  [Cap_Taiyo_Yuden_TMK105B7104KV-FR_100nF]  (hidden comment: Cap_Taiyo_Yuden_TMK105B7104KV-FR_100nF)
C118  Capacitance: 100nF 25V X7R 0402  [Cap_Taiyo_Yuden_TMK105B7104KV-FR_100nF]  (hidden comment: Cap_Taiyo_Yuden_TMK105B7104KV-FR_100nF)
R79  Resistance: 0R 1% 0402  [Res_Vishay_CRCW04020000Z0EDC_0_Ohm]  (hidden comment: Res_Vishay_CRCW04020000Z0EDC_0_Ohm)
R80  300R 1% 0402  [RESC0402(1005)_L]
R81  Resistance: 0R 1% 0402  [Res_Vishay_CRCW04020000Z0EDC_0_Ohm]  (hidden comment: Res_Vishay_CRCW04020000Z0EDC_0_Ohm)
R82  Resistance: 0R 1% 0402  [Res_Vishay_CRCW04020000Z0EDC_0_Ohm]  (hidden comment: Res_Vishay_CRCW04020000Z0EDC_0_Ohm)
R83  Resistance: 0R 1% 0402  [Res_Vishay_CRCW04020000Z0EDC_0_Ohm]  (hidden comment: Res_Vishay_CRCW04020000Z0EDC_0_Ohm)
R84  Resistance: 0R 1% 0402  [Res_Vishay_CRCW04020000Z0EDC_0_Ohm]  (hidden comment: Res_Vishay_CRCW04020000Z0EDC_0_Ohm)
R85  Resistance: 0R 1% 0402  [Res_Vishay_CRCW04020000Z0EDC_0_Ohm]  (hidden comment: Res_Vishay_CRCW04020000Z0EDC_0_Ohm)
R86  Resistance: 0R 1% 0402  [Res_Vishay_CRCW04020000Z0EDC_0_Ohm]  (hidden comment: Res_Vishay_CRCW04020000Z0EDC_0_Ohm)
R87  Resistance: 0R 1% 0402  [Res_Vishay_CRCW04020000Z0EDC_0_Ohm]  (hidden comment: Res_Vishay_CRCW04020000Z0EDC_0_Ohm)
R88  Resistance: 0R 1% 0402  [Res_Vishay_CRCW04020000Z0EDC_0_Ohm]  (hidden comment: Res_Vishay_CRCW04020000Z0EDC_0_Ohm)
R89  Resistance: 0R 1% 0402  [Res_Vishay_CRCW04020000Z0EDC_0_Ohm]  (hidden comment: Res_Vishay_CRCW04020000Z0EDC_0_Ohm)
R90  Resistance: 0R 1% 0402  [Res_Vishay_CRCW04020000Z0EDC_0_Ohm]  (hidden comment: Res_Vishay_CRCW04020000Z0EDC_0_Ohm)
R91  Resistance: 0R 1% 0402  [Res_Vishay_CRCW04020000Z0EDC_0_Ohm]  (hidden comment: Res_Vishay_CRCW04020000Z0EDC_0_Ohm)
R92  Resistance: 0R 1% 0402  [Res_Vishay_CRCW04020000Z0EDC_0_Ohm]  (hidden comment: Res_Vishay_CRCW04020000Z0EDC_0_Ohm)
R93  Resistance: 0R 1% 0402  [Res_Vishay_CRCW04020000Z0EDC_0_Ohm]  (hidden comment: Res_Vishay_CRCW04020000Z0EDC_0_Ohm)
R94  Resistance: 0R 1% 0402  [Res_Vishay_CRCW04020000Z0EDC_0_Ohm]  (hidden comment: Res_Vishay_CRCW04020000Z0EDC_0_Ohm)
R95  Resistance: 0R 1% 0402  [Res_Vishay_CRCW04020000Z0EDC_0_Ohm]  (hidden comment: Res_Vishay_CRCW04020000Z0EDC_0_Ohm)
R96  Resistance: 0R 1% 0402  [Res_Vishay_CRCW04020000Z0EDC_0_Ohm]  (hidden comment: Res_Vishay_CRCW04020000Z0EDC_0_Ohm)
R97  Resistance: 0R 1% 0402  [Res_Vishay_CRCW04020000Z0EDC_0_Ohm]  (hidden comment: Res_Vishay_CRCW04020000Z0EDC_0_Ohm)
R98  Resistance: 0R 1% 0402  [Res_Vishay_CRCW04020000Z0EDC_0_Ohm]  (hidden comment: Res_Vishay_CRCW04020000Z0EDC_0_Ohm)
R333  Resistance: 0R 1% 0402  [Res_Vishay_CRCW04020000Z0EDC_0_Ohm]  (hidden comment: Res_Vishay_CRCW04020000Z0EDC_0_Ohm)
U20  Series: CY8C9560A-24AXI  [IC_Cypress_Semiconductor_CY8C9560A-24AXI]  (hidden comment: IC_Cypress_Semiconductor_CY8C9560A-24AXI)

### Ports
CLK_SYNTH (harness CLK SYNTH CONTROL), CY8C9560A_INT (out), HMC849_Control_0 (harness HMC849 Control 0), I2C_GPIOExpander (harness GPIO Expander I2C), LT_DAC_~{CLR} (out), LT_DAC_~{IRQ} (in), TCA_EN (harness TCA EN), VCAL_RESET (out), ~{SHDN} (out)

### Harnesses
HMC849 Control 0: EN0, VCTL0, EN1, VCTL1, EN2, VCTL2, EN3, VCTL3, EN4, VCTL4, EN5, VCTL5, EN6, VCTL6, EN7, VCTL7, EN8, VCTL8
GPIO Expander I2C: SCL, SDA
TCA EN: TCA_CLK_0T05_EN, TCA_CLK_6T08_EN
CLK SYNTH CONTROL: ~{RST}, OE, IN_SEL0, IN_SEL1, FDEC, FINC

### Nets
3.3V: C114.1 C115.2 C116.2 C117.2 C118.2 U20.32(VDD) U20.82(VDD) U20.83(VDD)
TRB_GND: C114.2 C115.1 C116.1 C117.1 C118.1 R80.2 U20.15(VSS) U20.34(VSS) U20.65(VSS) U20.84(VSS) U20.85(VSS)
CY8_INT: R333.2 U20.45(INT)
HMC849:EN0: R79.2 ; port HMC849_Control_0.EN0
HMC849:EN1: R82.2 ; port HMC849_Control_0.EN1
HMC849:EN2: R84.2 ; port HMC849_Control_0.EN2
HMC849:EN3: R86.2 ; port HMC849_Control_0.EN3
HMC849:EN4: R88.2 ; port HMC849_Control_0.EN4
HMC849:EN5: R90.2 ; port HMC849_Control_0.EN5
HMC849:EN6: R92.2 ; port HMC849_Control_0.EN6
HMC849:EN7: R94.2 ; port HMC849_Control_0.EN7
HMC849:EN8: R96.2 ; port HMC849_Control_0.EN8
HMC849:VCTL0: R81.2 ; port HMC849_Control_0.VCTL0
HMC849:VCTL1: R83.2 ; port HMC849_Control_0.VCTL1
HMC849:VCTL2: R85.2 ; port HMC849_Control_0.VCTL2
HMC849:VCTL3: R87.2 ; port HMC849_Control_0.VCTL3
HMC849:VCTL4: R89.2 ; port HMC849_Control_0.VCTL4
HMC849:VCTL5: R91.2 ; port HMC849_Control_0.VCTL5
HMC849:VCTL6: R93.2 ; port HMC849_Control_0.VCTL6
HMC849:VCTL7: R95.2 ; port HMC849_Control_0.VCTL7
HMC849:VCTL8: R97.2 ; port HMC849_Control_0.VCTL8
HMC849_EN0: R79.1 U20.38(GP7[5])
HMC849_EN1: R82.1 U20.40(GP7[3])
HMC849_EN2: R84.1 U20.42(GP7[1])
HMC849_EN3: R86.1 U20.46(GP2[1])
HMC849_EN4: R88.1 U20.53(GP5[0])
HMC849_EN5: R90.1 U20.55(GP5[5])
HMC849_EN6: R92.1 U20.57(GP4[6])
HMC849_EN7: R94.1 U20.59(GP4[4])
HMC849_EN8: R96.1 U20.64(GP4[2])
HMC849_VCTL0: R81.1 U20.39(GP7[4])
HMC849_VCTL1: R83.1 U20.41(GP7[2])
HMC849_VCTL2: R85.1 U20.43(GP7[0])
HMC849_VCTL3: R87.1 U20.47(GP2[0])
HMC849_VCTL4: R89.1 U20.52(GP5[1])
HMC849_VCTL5: R91.1 U20.54(GP5[4])
HMC849_VCTL6: R93.1 U20.56(GP4[7])
HMC849_VCTL7: R95.1 U20.58(GP4[5])
HMC849_VCTL8: R97.1 U20.63(GP4[3])
IO_B35_L15_AD12_F20_N: R333.1 ; port CY8C9560A_INT
LT_DAC_~{CLR}: U20.5(GP0[5]) ; port LT_DAC_~{CLR}  [project net DAC_~{CLR}]
LT_DAC_~{IRQ}: U20.4(GP0[4]) ; port LT_DAC_~{IRQ}  [project net DAC_~{IRQ}]
~{SHDN}: U20.66(GP4[1]) ; port ~{SHDN}
SCL_CY8C9560A: U20.24(SCL) ; port I2C_GPIOExpander.SCL
SDA_CY8C9560A: U20.28(SDA) ; port I2C_GPIOExpander.SDA
Si5395_FDEC: U20.10(GP3[2]) ; port CLK_SYNTH.FDEC
Si5395_FINC: U20.7(GP0[7]) ; port CLK_SYNTH.FINC
Si5395_IN_SEL0: port CLK_SYNTH.IN_SEL0
Si5395_IN_SEL1: port CLK_SYNTH.IN_SEL1
Si5395_~{OE}: U20.9(GP3[1]) ; port CLK_SYNTH.OE
Si5395_~{RST}: U20.8(GP3[0]) ; port CLK_SYNTH.~{RST}
TCA_CLK_0T05_EN: U20.37(GP7[6]) ; port TCA_EN.TCA_CLK_0T05_EN
TCA_CLK_6T08_EN: U20.36(GP7[7]) ; port TCA_EN.TCA_CLK_6T08_EN
VCAL_RESET: R98.1 ; port VCAL_RESET
VCAL_RST: R98.2 U20.16(GP3[4])
NetR80_1: R80.1 U20.30(A0)

Not connected (* = marked no-connect by the designer): U20 1(DNU)* 2(DNU)* 3(GP0[3])* 6(GP0[6]) 11(GP3[3])* 12(DNU)* 13(DNU)* 14(DNU)* 17(GP3[5])* 18(GP3[6])* 19(GP3[7])* 20(GP5[7])* 21(GP5[6])* 22(GP5[2])* 23(GP5[3])* 25(DNU)* 26(DNU)* 27(DNU)* 29(GP2[3])* 31(DNU)* 33(DNU)* 35(DNU)* 44(GP2[2]) 48(DNU)* 49(DNU)* 50(DNU)* 51(DNU)* 60(DNU)* 61(DNU)* 62(XRES) 67(GP4[0])* 68(GP1[7])* 69(GP1[6])* 70(GP1[5])* 71(DNU)* 72(GP1[4])* 73(DNU)* 74(GP1[3])* 75(DNU)* 76(DNU)* 77(GP1[2]) 78(DNU)* 79(GP1[1])* 80(DNU)* 81(GP1[0])* 86(GP6[0])* 87(GP6[1])* 88(GP6[2])* 89(GP6[3])* 90(GP6[4])* 91(GP6[5])* 92(GP6[6])* 93(GP6[7])* 94(DNU)* 95(GP0[0]) 96(DNU)* 97(GP0[1]) 98(DNU)* 99(GP0[2]) 100(DNU)*

### Notes on the sheet
- (near R79) Place close to CY8C9560A Expander
- GP4[0]-GP0[3] reserved for 2nd HMC849
- Multi-Port ADDRESS: 0X20
- EEPROM ADDRESS: 0X50
- Si5395 Clock Control
- (near R333) CY8C9560A Interrupt
- (near R98) AD5675 DAC Reset
- LTC6269 Op-Amp Shutdown
- (near C117) Place decoupling capacitors
- 475 Portola Plaza
- GAPS TOF
- igarcia91@g.ucla.edu
- Los Angeles, CA
- 310-825-0344
- Size:
- Date:
- Letter
- Number:
- Time:
- Sheet
- Revision:
- of
- andrew.peck@cern.ch
- spq@ucla.edu
- File:

### Library data of the parts
C114 = Cap_Murata_ GRM21BC71E106ME11L_10uF: CAP CER 10uF 25V X7R 0805; Supplier 1: Mouser; Supplier Part Number 1: 81-GRM21BC71E106ME1L
C115-C118 = Cap_Taiyo_Yuden_TMK105B7104KV-FR_100nF: CAP CER 100nF 25V X7R 0402; Supplier 1: Mouser; Supplier Part Number 1: 963-TMK105B7104KV-FR
R79 R81-R98 R333 = Res_Vishay_CRCW04020000Z0EDC_0_Ohm: 0R 0.062W 1% 0402 (1005 Metric)  SMD; Supplier 1: Mouser; Supplier Part Number 1: 71-CRCW04020000Z0EDC
R80 = CMP-1011-00449-1: 300R 0.063W 1% 0402 (1005 Metric)  SMD; Case-EIA: 0402; Value: 300.00 Ohm; Case-Metric: 1005; Tolerance: 1 %; Technology: SMT; Power: 0.063 W
U20 = IC_Cypress_Semiconductor_CY8C9560A-24AXI: Interface - I/O Expanders 60BIT IO EXPANDER W/EEPROM; Supplier 1: Mouser; Supplier Part Number 1: 727-CY8C9560A-24AXI

## Sheet GPIO_EXPANDER_LED.SchDoc: My title
size A3; Organization: University of California; Address1: 475 Portola Plaza; Address2: Los Angeles, CA 90095; Revision: R01; SheetNumber: 1; SheetTotal: 1
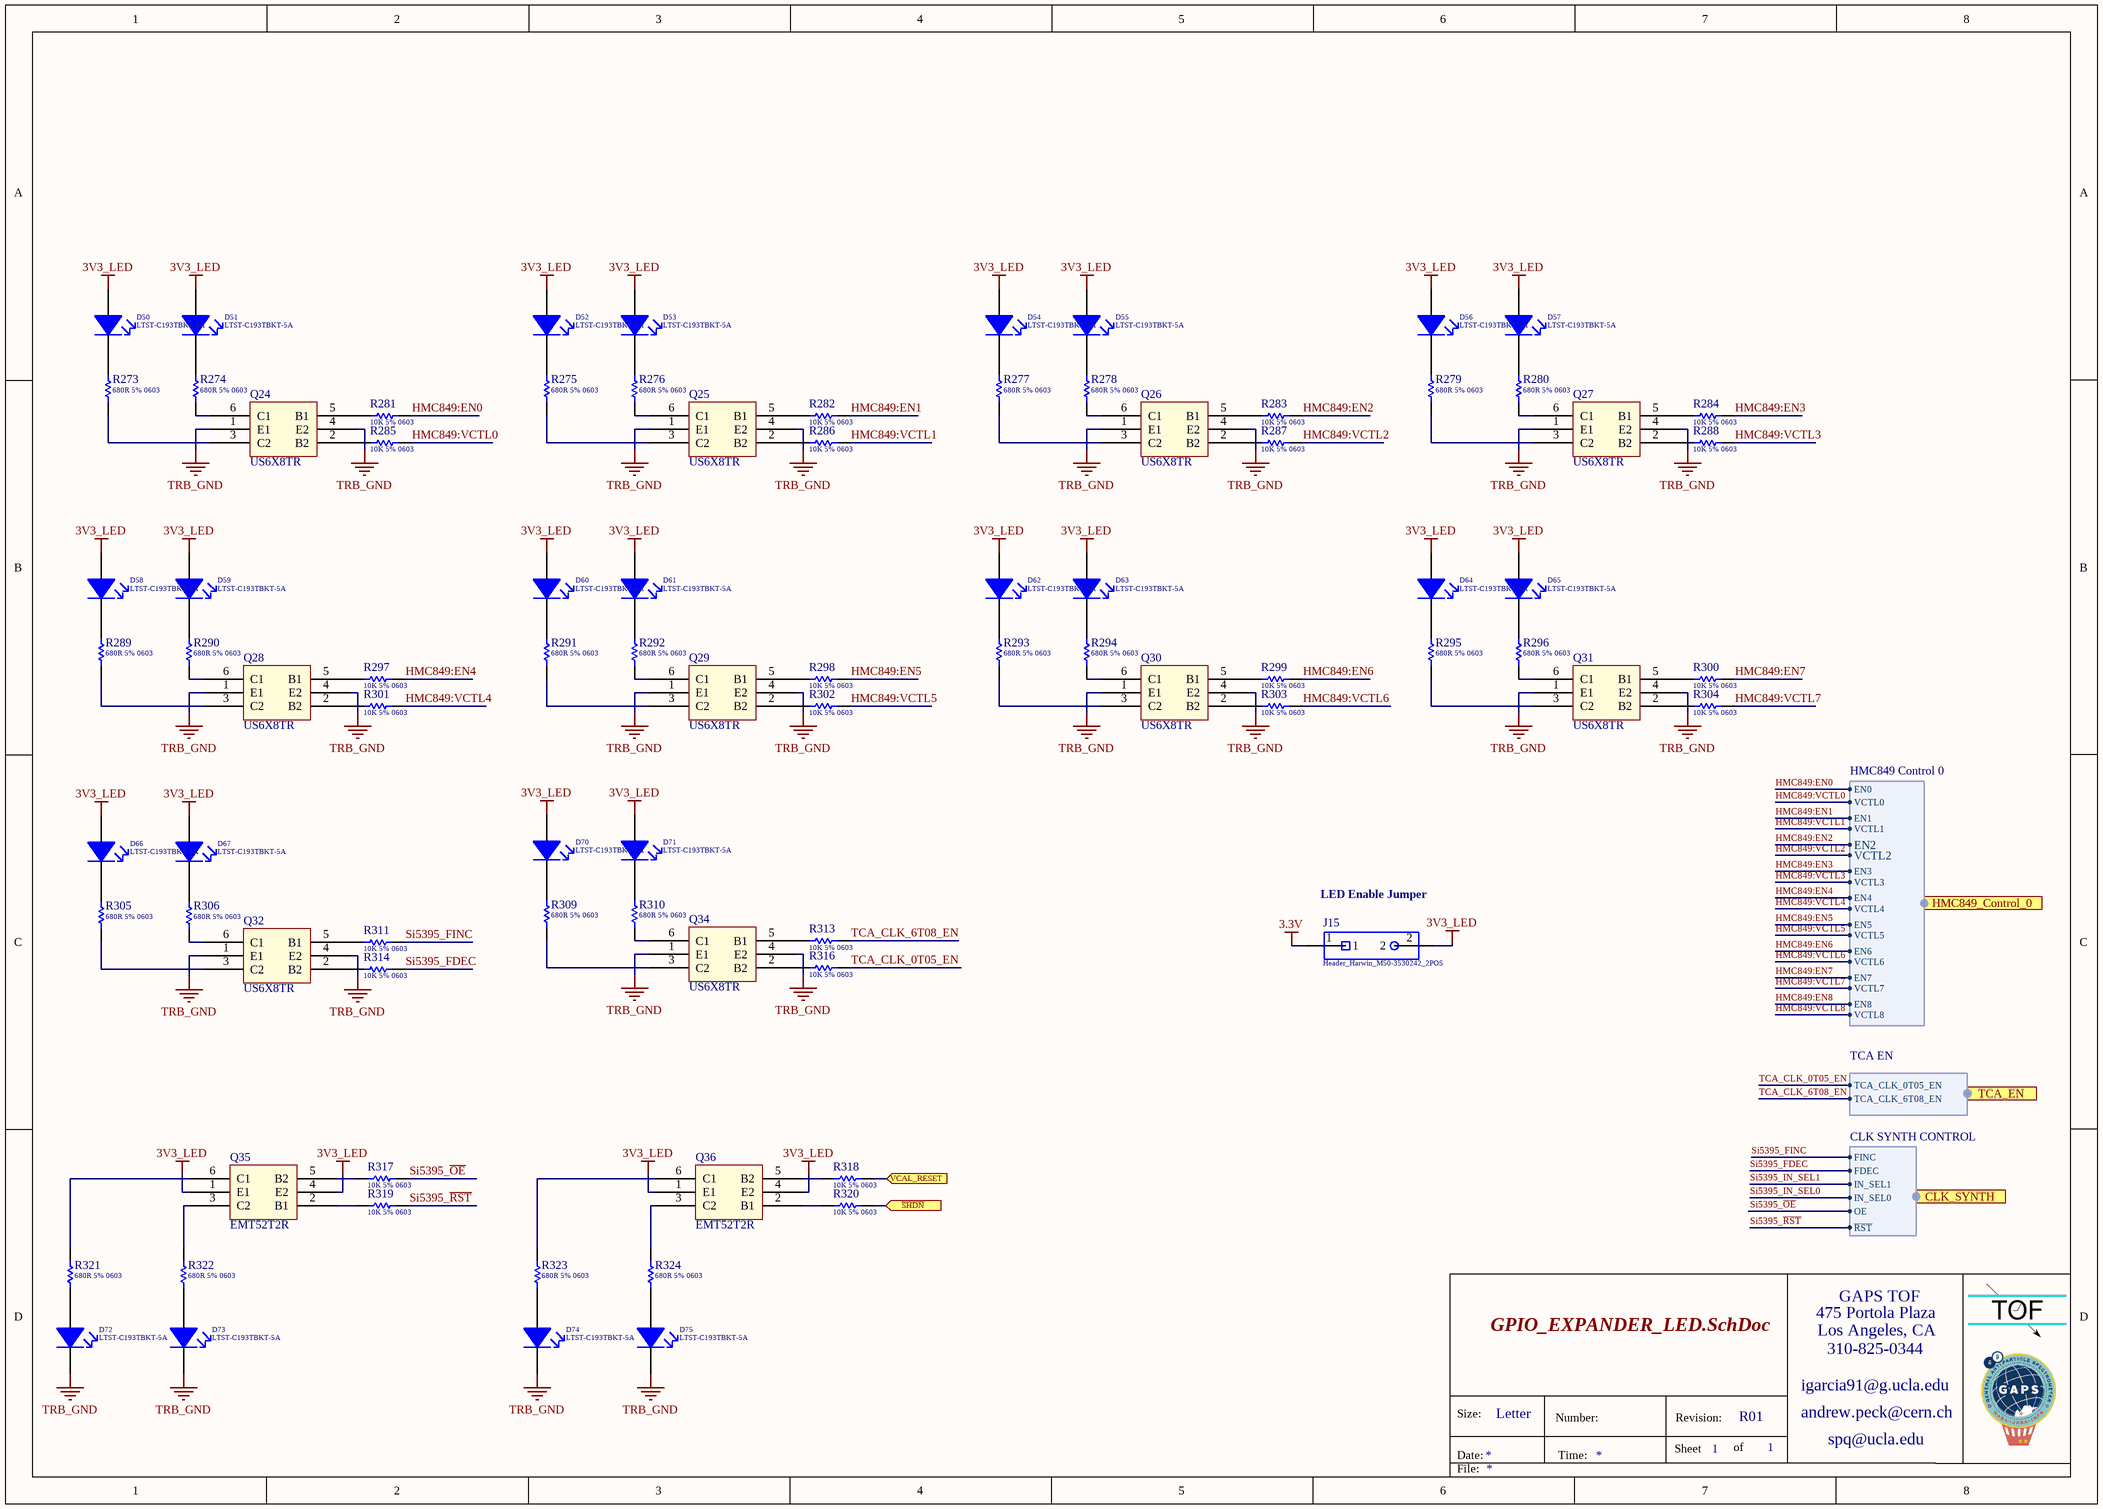
[diagram p28: GPIO_EXPANDER_LED.SchDoc]

### Parts
D50  Series: LTST-C193TBKT-5A  [Led_Lite-On_LTST-C193TBKT-5A_Blue]  (hidden comment: Led_Lite-On_LTST-C193TBKT-5A_Blue)
D51  Series: LTST-C193TBKT-5A  [Led_Lite-On_LTST-C193TBKT-5A_Blue]  (hidden comment: Led_Lite-On_LTST-C193TBKT-5A_Blue)
D52  Series: LTST-C193TBKT-5A  [Led_Lite-On_LTST-C193TBKT-5A_Blue]  (hidden comment: Led_Lite-On_LTST-C193TBKT-5A_Blue)
D53  Series: LTST-C193TBKT-5A  [Led_Lite-On_LTST-C193TBKT-5A_Blue]  (hidden comment: Led_Lite-On_LTST-C193TBKT-5A_Blue)
D54  Series: LTST-C193TBKT-5A  [Led_Lite-On_LTST-C193TBKT-5A_Blue]  (hidden comment: Led_Lite-On_LTST-C193TBKT-5A_Blue)
D55  Series: LTST-C193TBKT-5A  [Led_Lite-On_LTST-C193TBKT-5A_Blue]  (hidden comment: Led_Lite-On_LTST-C193TBKT-5A_Blue)
D56  Series: LTST-C193TBKT-5A  [Led_Lite-On_LTST-C193TBKT-5A_Blue]  (hidden comment: Led_Lite-On_LTST-C193TBKT-5A_Blue)
D57  Series: LTST-C193TBKT-5A  [Led_Lite-On_LTST-C193TBKT-5A_Blue]  (hidden comment: Led_Lite-On_LTST-C193TBKT-5A_Blue)
D58  Series: LTST-C193TBKT-5A  [Led_Lite-On_LTST-C193TBKT-5A_Blue]  (hidden comment: Led_Lite-On_LTST-C193TBKT-5A_Blue)
D59  Series: LTST-C193TBKT-5A  [Led_Lite-On_LTST-C193TBKT-5A_Blue]  (hidden comment: Led_Lite-On_LTST-C193TBKT-5A_Blue)
D60  Series: LTST-C193TBKT-5A  [Led_Lite-On_LTST-C193TBKT-5A_Blue]  (hidden comment: Led_Lite-On_LTST-C193TBKT-5A_Blue)
D61  Series: LTST-C193TBKT-5A  [Led_Lite-On_LTST-C193TBKT-5A_Blue]  (hidden comment: Led_Lite-On_LTST-C193TBKT-5A_Blue)
D62  Series: LTST-C193TBKT-5A  [Led_Lite-On_LTST-C193TBKT-5A_Blue]  (hidden comment: Led_Lite-On_LTST-C193TBKT-5A_Blue)
D63  Series: LTST-C193TBKT-5A  [Led_Lite-On_LTST-C193TBKT-5A_Blue]  (hidden comment: Led_Lite-On_LTST-C193TBKT-5A_Blue)
D64  Series: LTST-C193TBKT-5A  [Led_Lite-On_LTST-C193TBKT-5A_Blue]  (hidden comment: Led_Lite-On_LTST-C193TBKT-5A_Blue)
D65  Series: LTST-C193TBKT-5A  [Led_Lite-On_LTST-C193TBKT-5A_Blue]  (hidden comment: Led_Lite-On_LTST-C193TBKT-5A_Blue)
D66  Series: LTST-C193TBKT-5A  [Led_Lite-On_LTST-C193TBKT-5A_Blue]  (hidden comment: Led_Lite-On_LTST-C193TBKT-5A_Blue)
D67  Series: LTST-C193TBKT-5A  [Led_Lite-On_LTST-C193TBKT-5A_Blue]  (hidden comment: Led_Lite-On_LTST-C193TBKT-5A_Blue)
D70  Series: LTST-C193TBKT-5A  [Led_Lite-On_LTST-C193TBKT-5A_Blue]  (hidden comment: Led_Lite-On_LTST-C193TBKT-5A_Blue)
D71  Series: LTST-C193TBKT-5A  [Led_Lite-On_LTST-C193TBKT-5A_Blue]  (hidden comment: Led_Lite-On_LTST-C193TBKT-5A_Blue)
D72  Series: LTST-C193TBKT-5A  [Led_Lite-On_LTST-C193TBKT-5A_Blue]  (hidden comment: Led_Lite-On_LTST-C193TBKT-5A_Blue)
D73  Series: LTST-C193TBKT-5A  [Led_Lite-On_LTST-C193TBKT-5A_Blue]  (hidden comment: Led_Lite-On_LTST-C193TBKT-5A_Blue)
D74  Series: LTST-C193TBKT-5A  [Led_Lite-On_LTST-C193TBKT-5A_Blue]  (hidden comment: Led_Lite-On_LTST-C193TBKT-5A_Blue)
D75  Series: LTST-C193TBKT-5A  [Led_Lite-On_LTST-C193TBKT-5A_Blue]  (hidden comment: Led_Lite-On_LTST-C193TBKT-5A_Blue)
J15  Header_Harwin_M50-3530242_2POS  [Header_Harwin_M50-3530242_2POS]
Q24  Series: US6X8TR  [BJT_ROHM_US6X8TR_1A_NPN]  (hidden comment: BJT_ROHM_US6X8TR_1A_NPN)
Q25  Series: US6X8TR  [BJT_ROHM_US6X8TR_1A_NPN]  (hidden comment: BJT_ROHM_US6X8TR_1A_NPN)
Q26  Series: US6X8TR  [BJT_ROHM_US6X8TR_1A_NPN]  (hidden comment: BJT_ROHM_US6X8TR_1A_NPN)
Q27  Series: US6X8TR  [BJT_ROHM_US6X8TR_1A_NPN]  (hidden comment: BJT_ROHM_US6X8TR_1A_NPN)
Q28  Series: US6X8TR  [BJT_ROHM_US6X8TR_1A_NPN]  (hidden comment: BJT_ROHM_US6X8TR_1A_NPN)
Q29  Series: US6X8TR  [BJT_ROHM_US6X8TR_1A_NPN]  (hidden comment: BJT_ROHM_US6X8TR_1A_NPN)
Q30  Series: US6X8TR  [BJT_ROHM_US6X8TR_1A_NPN]  (hidden comment: BJT_ROHM_US6X8TR_1A_NPN)
Q31  Series: US6X8TR  [BJT_ROHM_US6X8TR_1A_NPN]  (hidden comment: BJT_ROHM_US6X8TR_1A_NPN)
Q32  Series: US6X8TR  [BJT_ROHM_US6X8TR_1A_NPN]  (hidden comment: BJT_ROHM_US6X8TR_1A_NPN)
Q34  Series: US6X8TR  [BJT_ROHM_US6X8TR_1A_NPN]  (hidden comment: BJT_ROHM_US6X8TR_1A_NPN)
Q35  Series: EMT52T2R  [BJT_ROHM_EMT52T2R_100mA_PNP]  (hidden comment: BJT_ROHM_EMT52T2R_100mA_PNP)
Q36  Series: EMT52T2R  [BJT_ROHM_EMT52T2R_100mA_PNP]  (hidden comment: BJT_ROHM_EMT52T2R_100mA_PNP)
R273  680R 5% 0603  [RESC0603(1608)_L]
R274  680R 5% 0603  [RESC0603(1608)_L]
R275  680R 5% 0603  [RESC0603(1608)_L]
R276  680R 5% 0603  [RESC0603(1608)_L]
R277  680R 5% 0603  [RESC0603(1608)_L]
R278  680R 5% 0603  [RESC0603(1608)_L]
R279  680R 5% 0603  [RESC0603(1608)_L]
R280  680R 5% 0603  [RESC0603(1608)_L]
R281  10K 5% 0603  [RESC0603(1608)_L]
R282  10K 5% 0603  [RESC0603(1608)_L]
R283  10K 5% 0603  [RESC0603(1608)_L]
R284  10K 5% 0603  [RESC0603(1608)_L]
R285  10K 5% 0603  [RESC0603(1608)_L]
R286  10K 5% 0603  [RESC0603(1608)_L]
R287  10K 5% 0603  [RESC0603(1608)_L]
R288  10K 5% 0603  [RESC0603(1608)_L]
R289  680R 5% 0603  [RESC0603(1608)_L]
R290  680R 5% 0603  [RESC0603(1608)_L]
R291  680R 5% 0603  [RESC0603(1608)_L]
R292  680R 5% 0603  [RESC0603(1608)_L]
R293  680R 5% 0603  [RESC0603(1608)_L]
R294  680R 5% 0603  [RESC0603(1608)_L]
R295  680R 5% 0603  [RESC0603(1608)_L]
R296  680R 5% 0603  [RESC0603(1608)_L]
R297  10K 5% 0603  [RESC0603(1608)_L]
R298  10K 5% 0603  [RESC0603(1608)_L]
R299  10K 5% 0603  [RESC0603(1608)_L]
R300  10K 5% 0603  [RESC0603(1608)_L]
R301  10K 5% 0603  [RESC0603(1608)_L]
R302  10K 5% 0603  [RESC0603(1608)_L]
R303  10K 5% 0603  [RESC0603(1608)_L]
R304  10K 5% 0603  [RESC0603(1608)_L]
R305  680R 5% 0603  [RESC0603(1608)_L]
R306  680R 5% 0603  [RESC0603(1608)_L]
R309  680R 5% 0603  [RESC0603(1608)_L]
R310  680R 5% 0603  [RESC0603(1608)_L]
R311  10K 5% 0603  [RESC0603(1608)_L]
R313  10K 5% 0603  [RESC0603(1608)_L]
R314  10K 5% 0603  [RESC0603(1608)_L]
R316  10K 5% 0603  [RESC0603(1608)_L]
R317  10K 5% 0603  [RESC0603(1608)_L]
R318  10K 5% 0603  [RESC0603(1608)_L]
R319  10K 5% 0603  [RESC0603(1608)_L]
R320  10K 5% 0603  [RESC0603(1608)_L]
R321  680R 5% 0603  [RESC0603(1608)_L]
R322  680R 5% 0603  [RESC0603(1608)_L]
R323  680R 5% 0603  [RESC0603(1608)_L]
R324  680R 5% 0603  [RESC0603(1608)_L]

### Ports
CLK_SYNTH (harness CLK SYNTH CONTROL), HMC849_Control_0 (harness HMC849 Control 0), TCA_EN (harness TCA EN), VCAL_RESET (in), ~{SHDN} (in)

### Harnesses
HMC849 Control 0: EN0, VCTL0, EN1, VCTL1, EN2, VCTL2, EN3, VCTL3, EN4, VCTL4, EN5, VCTL5, EN6, VCTL6, EN7, VCTL7, EN8, VCTL8
TCA EN: TCA_CLK_0T05_EN, TCA_CLK_6T08_EN
CLK SYNTH CONTROL: ~{RST}, OE, IN_SEL0, IN_SEL1, FDEC, FINC

### Nets
3.3V: J15.1
3V3_LED: D50.2(A) D51.2(A) D52.2(A) D53.2(A) D54.2(A) D55.2(A) D56.2(A) D57.2(A) D58.2(A) D59.2(A) D60.2(A) D61.2(A) D62.2(A) D63.2(A) D64.2(A) D65.2(A) D66.2(A) D67.2(A) D70.2(A) D71.2(A) J15.2 Q35.1(E1) Q35.4(E2) Q36.1(E1) Q36.4(E2)
TRB_GND: D72.1(K) D73.1(K) D74.1(K) D75.1(K) Q24.1(E1) Q24.4(E2) Q25.1(E1) Q25.4(E2) Q26.1(E1) Q26.4(E2) Q27.1(E1) Q27.4(E2) Q28.1(E1) Q28.4(E2) Q29.1(E1) Q29.4(E2) Q30.1(E1) Q30.4(E2) Q31.1(E1) Q31.4(E2) Q32.1(E1) Q32.4(E2) Q34.1(E1) Q34.4(E2)
HMC849:EN0: R281.2 ; port HMC849_Control_0.EN0
HMC849:EN1: R282.2 ; port HMC849_Control_0.EN1
HMC849:EN2: R283.2 ; port HMC849_Control_0.EN2
HMC849:EN3: R284.2 ; port HMC849_Control_0.EN3
HMC849:EN4: R297.2 ; port HMC849_Control_0.EN4
HMC849:EN5: R298.2 ; port HMC849_Control_0.EN5
HMC849:EN6: R299.2 ; port HMC849_Control_0.EN6
HMC849:EN7: R300.2 ; port HMC849_Control_0.EN7
HMC849:VCTL0: R285.1 ; port HMC849_Control_0.VCTL0
HMC849:VCTL1: R286.1 ; port HMC849_Control_0.VCTL1
HMC849:VCTL2: R287.1 ; port HMC849_Control_0.VCTL2
HMC849:VCTL3: R288.1 ; port HMC849_Control_0.VCTL3
HMC849:VCTL4: R301.1 ; port HMC849_Control_0.VCTL4
HMC849:VCTL5: R302.1 ; port HMC849_Control_0.VCTL5
HMC849:VCTL6: R303.1 ; port HMC849_Control_0.VCTL6
HMC849:VCTL7: R304.1 ; port HMC849_Control_0.VCTL7
~{SHDN}: R320.2 ; port ~{SHDN}
Si5395_FDEC: R314.1 ; port CLK_SYNTH.FDEC
Si5395_FINC: R311.2 ; port CLK_SYNTH.FINC
Si5395_IN_SEL0: port CLK_SYNTH.IN_SEL0
Si5395_IN_SEL1: port CLK_SYNTH.IN_SEL1
Si5395_~{OE}: R317.1 ; port CLK_SYNTH.OE
Si5395_~{RST}: R319.2 ; port CLK_SYNTH.~{RST}
TCA_CLK_0T05_EN: R316.1 ; port TCA_EN.TCA_CLK_0T05_EN
TCA_CLK_6T08_EN: R313.2 ; port TCA_EN.TCA_CLK_6T08_EN
VCAL_RESET: R318.1 ; port VCAL_RESET
NetD50_1: D50.1(K) R273.2
NetD51_1: D51.1(K) R274.2
NetD52_1: D52.1(K) R275.2
NetD53_1: D53.1(K) R276.2
NetD54_1: D54.1(K) R277.2
NetD55_1: D55.1(K) R278.2
NetD56_1: D56.1(K) R279.2
NetD57_1: D57.1(K) R280.2
NetD58_1: D58.1(K) R289.2
NetD59_1: D59.1(K) R290.2
NetD60_1: D60.1(K) R291.2
NetD61_1: D61.1(K) R292.2
NetD62_1: D62.1(K) R293.2
NetD63_1: D63.1(K) R294.2
NetD64_1: D64.1(K) R295.2
NetD65_1: D65.1(K) R296.2
NetD66_1: D66.1(K) R305.2
NetD67_1: D67.1(K) R306.2
NetD70_1: D70.1(K) R309.2
NetD71_1: D71.1(K) R310.2
NetD72_2: D72.2(A) R321.1
NetD73_2: D73.2(A) R322.1
NetD74_2: D74.2(A) R323.1
NetD75_2: D75.2(A) R324.1
NetQ24_2: Q24.2(B2) R285.2
NetQ24_3: Q24.3(C2) R273.1
NetQ24_5: Q24.5(B1) R281.1
NetQ24_6: Q24.6(C1) R274.1
NetQ25_2: Q25.2(B2) R286.2
NetQ25_3: Q25.3(C2) R275.1
NetQ25_5: Q25.5(B1) R282.1
NetQ25_6: Q25.6(C1) R276.1
NetQ26_2: Q26.2(B2) R287.2
NetQ26_3: Q26.3(C2) R277.1
NetQ26_5: Q26.5(B1) R283.1
NetQ26_6: Q26.6(C1) R278.1
NetQ27_2: Q27.2(B2) R288.2
NetQ27_3: Q27.3(C2) R279.1
NetQ27_5: Q27.5(B1) R284.1
NetQ27_6: Q27.6(C1) R280.1
NetQ28_2: Q28.2(B2) R301.2
NetQ28_3: Q28.3(C2) R289.1
NetQ28_5: Q28.5(B1) R297.1
NetQ28_6: Q28.6(C1) R290.1
NetQ29_2: Q29.2(B2) R302.2
NetQ29_3: Q29.3(C2) R291.1
NetQ29_5: Q29.5(B1) R298.1
NetQ29_6: Q29.6(C1) R292.1
NetQ30_2: Q30.2(B2) R303.2
NetQ30_3: Q30.3(C2) R293.1
NetQ30_5: Q30.5(B1) R299.1
NetQ30_6: Q30.6(C1) R294.1
NetQ31_2: Q31.2(B2) R304.2
NetQ31_3: Q31.3(C2) R295.1
NetQ31_5: Q31.5(B1) R300.1
NetQ31_6: Q31.6(C1) R296.1
NetQ32_2: Q32.2(B2) R314.2
NetQ32_3: Q32.3(C2) R305.1
NetQ32_5: Q32.5(B1) R311.1
NetQ32_6: Q32.6(C1) R306.1
NetQ34_2: Q34.2(B2) R316.2
NetQ34_3: Q34.3(C2) R309.1
NetQ34_5: Q34.5(B1) R313.1
NetQ34_6: Q34.6(C1) R310.1
NetQ35_2: Q35.2(B1) R319.1
NetQ35_3: Q35.3(C2) R322.2
NetQ35_5: Q35.5(B2) R317.2
NetQ35_6: Q35.6(C1) R321.2
NetQ36_2: Q36.2(B1) R320.1
NetQ36_3: Q36.3(C2) R324.2
NetQ36_5: Q36.5(B2) R318.2
NetQ36_6: Q36.6(C1) R323.2

### Notes on the sheet
- (near J15) LED Enable Jumper
- 475 Portola Plaza
- GAPS TOF
- igarcia91@g.ucla.edu
- Los Angeles, CA
- 310-825-0344
- Size:
- Date:
- Letter
- Number:
- Time:
- Sheet
- Revision:
- of
- andrew.peck@cern.ch
- spq@ucla.edu
- File:

### Library data of the parts
D50-D67 D70-D75 = Led_Lite-On_LTST-C193TBKT-5A_Blue: as D34 on sheet MARS_FTDI; Supplier 1: Mouser; Supplier Part Number 1: 859-LTSTC193TBKT5A
J15 = Header_Harwin_M50-3530242_2POS: Headers & Wire Housings 2 WAY SIL VERT PC TAIL P/HDR; Supplier 1: Mouser; Supplier Part Number 1: 855-M50-3530242
Q24-Q32 Q34 = BJT_ROHM_US6X8TR_1A_NPN: as Q19 on sheet MARS_FTDI; Supplier Part Number 1: 755-US6X8TR; Supplier 1: Mouser
Q35 Q36 = BJT_ROHM_EMT52T2R_100mA_PNP: Bipolar Transistors - BJT Bipolar Transistor SOT-563 SC-107C EMT6; Supplier 1: Mouser; Supplier Part Number 1: 755-EMT52T2R
R273-R280 R289-R296 R305 R306 R309 R310 R321-R324 = CMP-1012-00070-1: as R211-R213 on sheet Sensors; Tolerance: 5 %; Technology: SMT; Power: 0.1 W
R281-R288 R297-R304 R311 R313 R314 R316-R320 = CMP-1012-00098-1: as R208-R210 on sheet Sensors; Technology: SMT; Tolerance: 5 %; Power: 0.1 W